# EAGLE design IOXGDv0.4.1 (EAGLE 9.5.0)
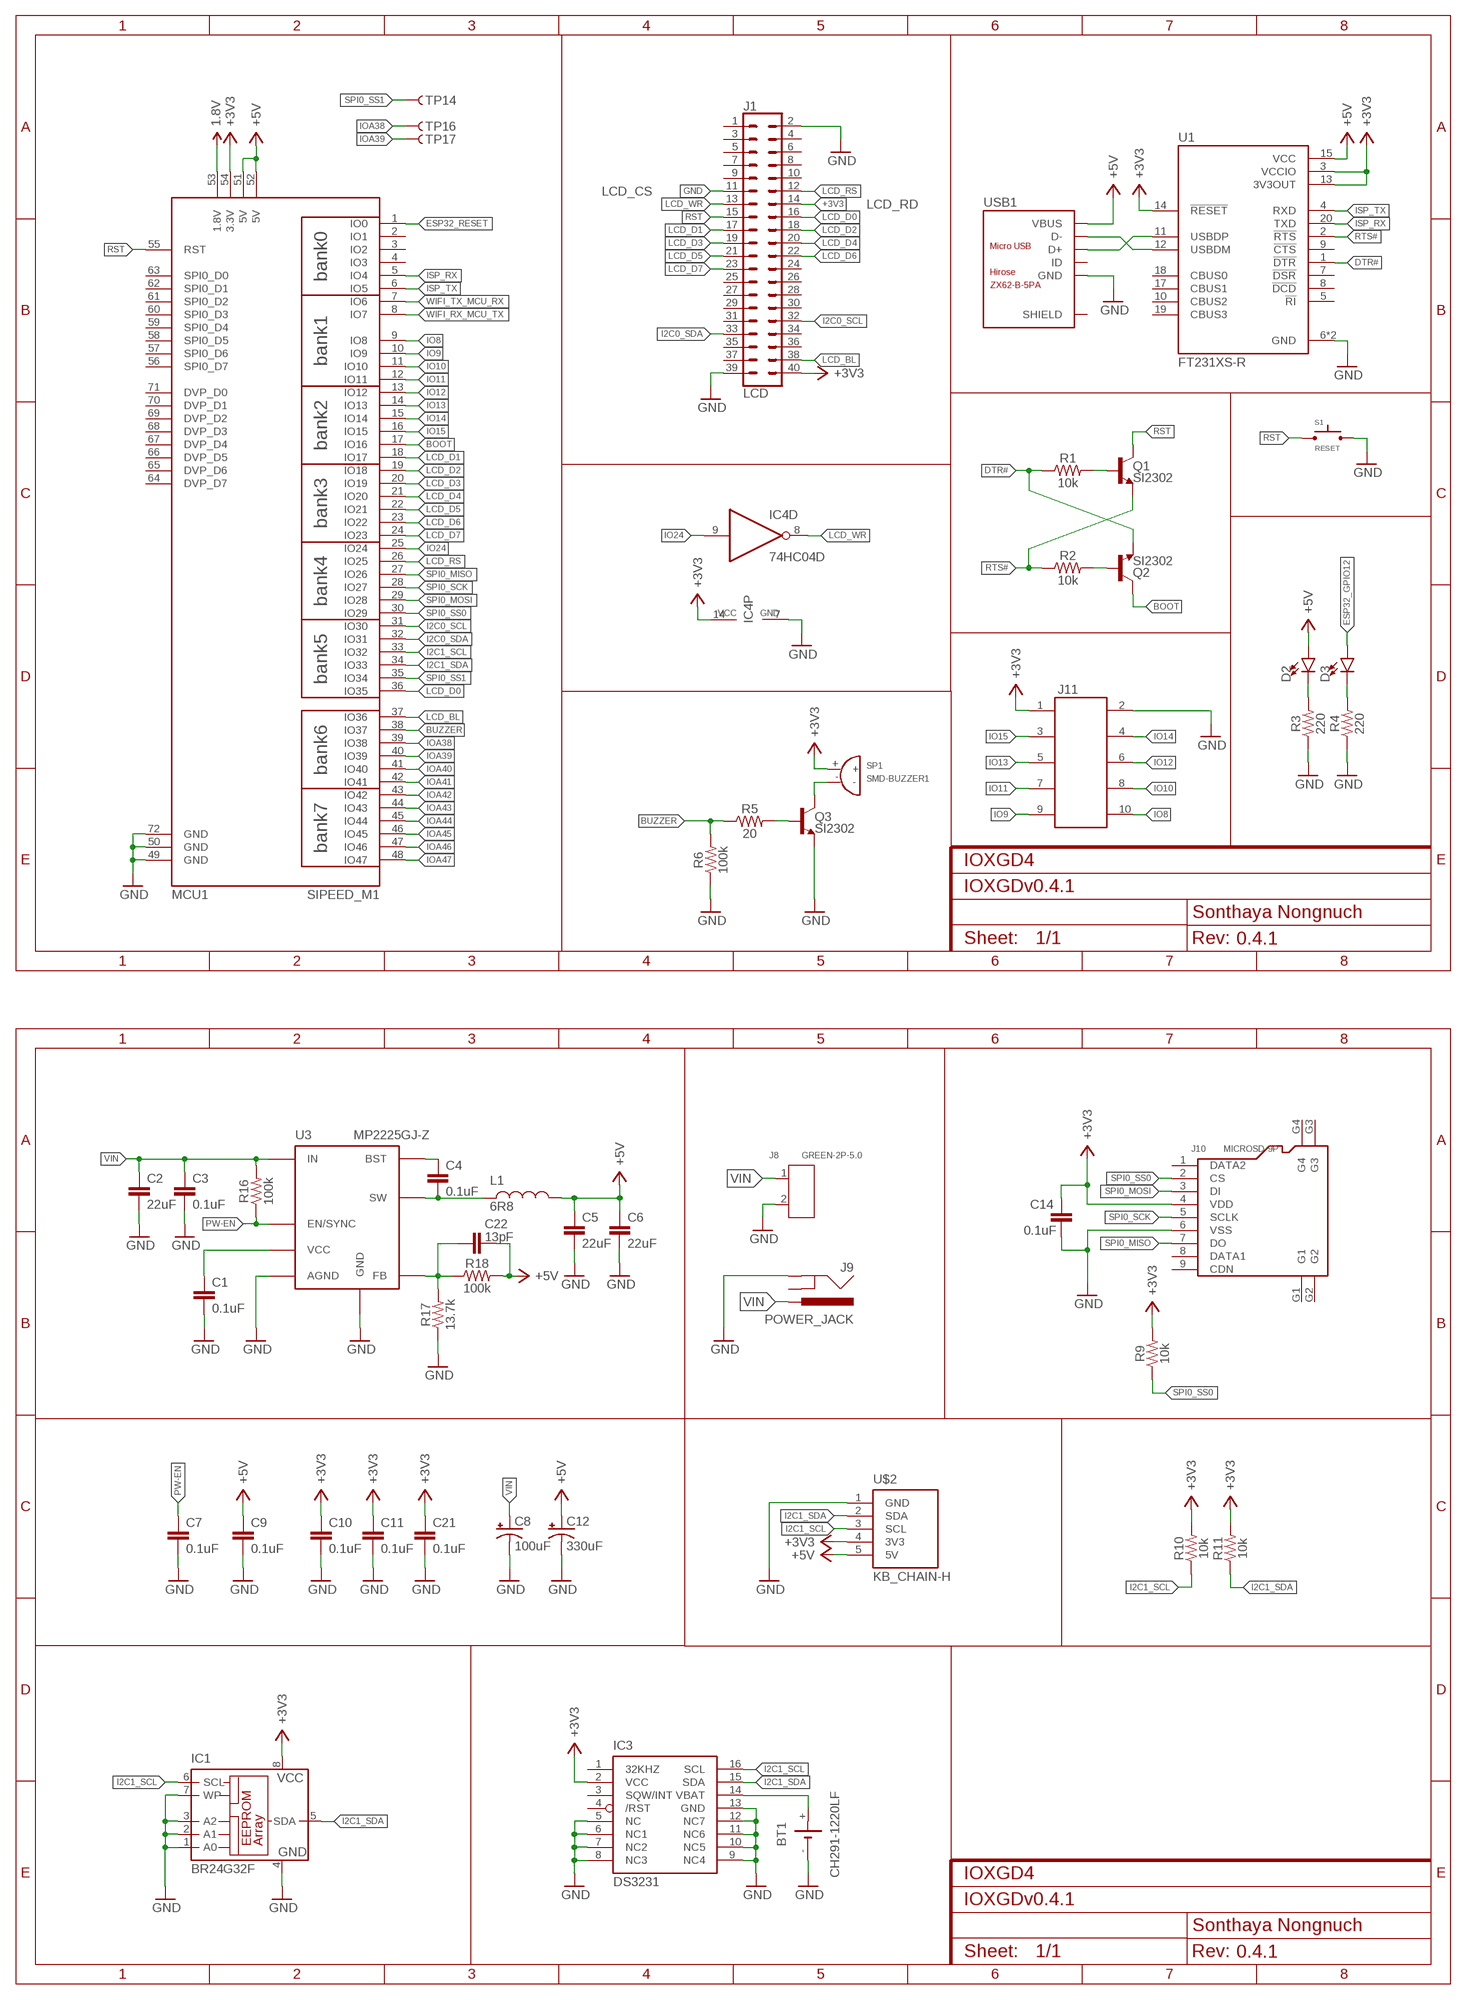
[diagram p0: schematic, sheet 1, part 1 of 2]
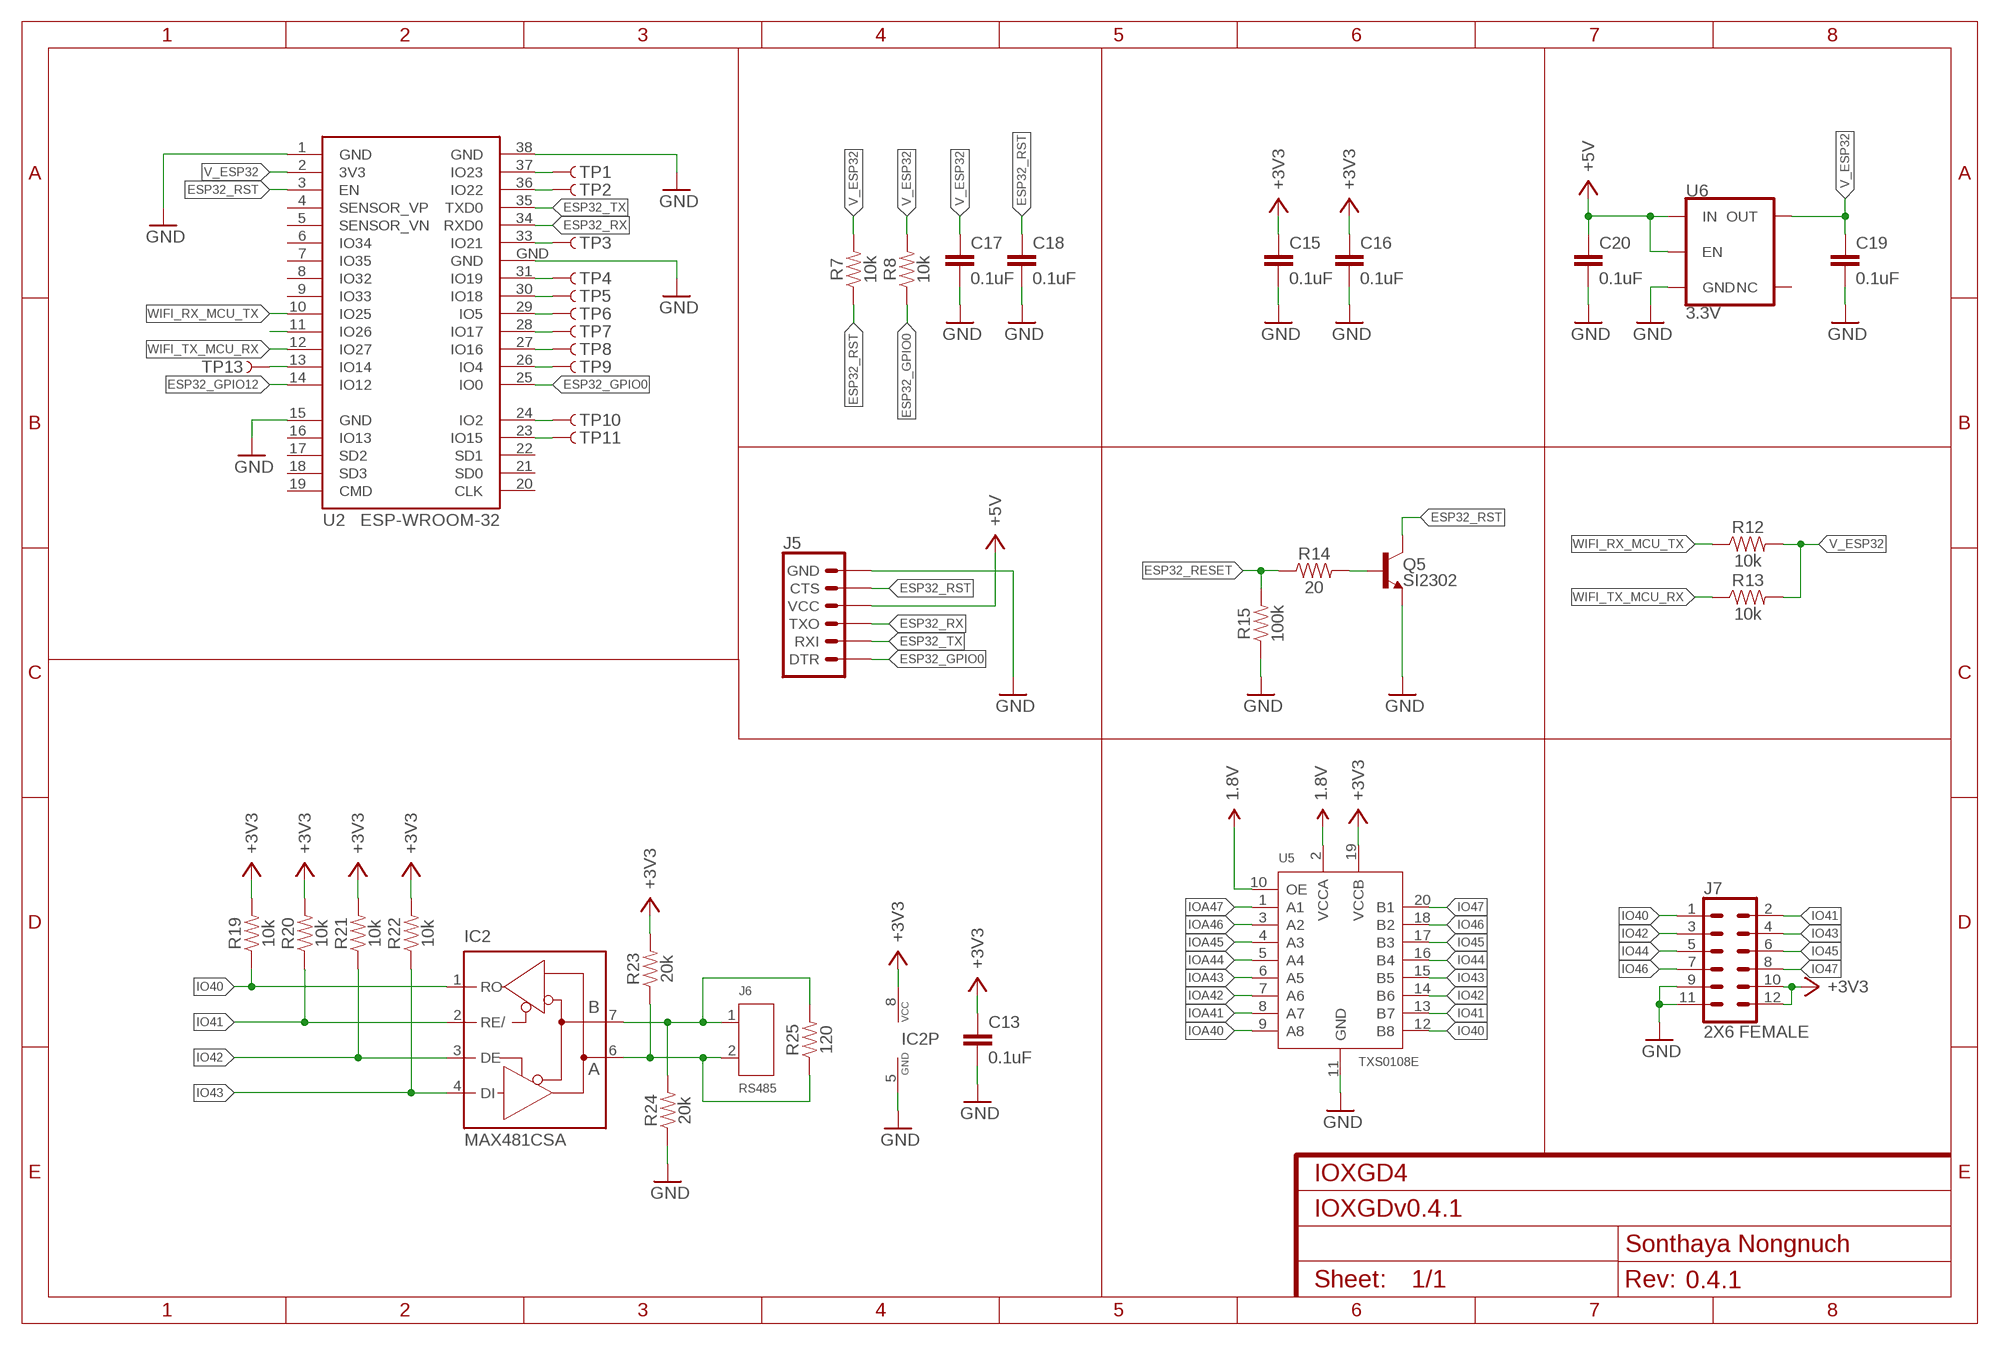
[diagram p1: schematic, sheet 1, part 2 of 2]
FRAME1 (FRAME-A4L): CNAME: IOXGD4; CREVISION: 0.4.1; DESIGNER: Sonthaya Nongnuch
FRAME2 (FRAME-A4L): CNAME: IOXGD4; CREVISION: 0.4.1; DESIGNER: Sonthaya Nongnuch
FRAME3 (FRAME-A4L): CNAME: IOXGD4; CREVISION: 0.4.1; DESIGNER: Sonthaya Nongnuch

## Parts
BT1  CH291-1220LF  [CH291-1220LF]
C1  0.1uF  0.1UF-0603-25V-(+80/-20%)  [0603]
C2  22uF  22UF-0805-6.3V-20%  [0805]
C3  0.1uF  0.1UF-0603-25V-(+80/-20%)  [0603]
C4  0.1uF  0.1UF-0603-25V-(+80/-20%)  [0603]
C5  22uF  0.1UF-0603-25V-(+80/-20%)  [0603]
C6  22uF  0.1UF-0603-25V-(+80/-20%)  [0603]
C7  0.1uF  0.1UF-0603-25V-(+80/-20%)  [0603]
C8  100uF  100UF-POLAR-RADIAL-2.5MM-25V-20%  [CPOL-RADIAL-2.5MM-6.5MM]
C9  0.1uF  0.1UF-0603-25V-(+80/-20%)  [0603]
C10  0.1uF  0.1UF-0603-25V-(+80/-20%)  [0603]
C11  0.1uF  0.1UF-0603-25V-(+80/-20%)  [0603]
C12  330uF  100UF-POLAR-RADIAL-2.5MM-25V-20%  [CPOL-RADIAL-2.5MM-6.5MM]
C13  0.1uF  0.1UF-0603-25V-(+80/-20%)  [0603]
C14  0.1uF  0.1UF-0603-25V-(+80/-20%)  [0603]
C15  0.1uF  0.1UF-0603-25V-(+80/-20%)  [0603]
C16  0.1uF  0.1UF-0603-25V-(+80/-20%)  [0603]
C17  0.1uF  0.1UF-0603-25V-(+80/-20%)  [0603]
C18  0.1uF  0.1UF-0603-25V-(+80/-20%)  [0603]
C19  0.1uF  0.1UF-0603-25V-(+80/-20%)  [0603]
C20  0.1uF  0.1UF-0603-25V-(+80/-20%)  [0603]
C21  0.1uF  0.1UF-0603-25V-(+80/-20%)  [0603]
C22  13pF  0.1UF-0603-25V-(+80/-20%)  [0603]
D2  LED3MM  [LED_3MM]
D3  LED3MM  [LED_3MM]
IC1  BR24G32F  24AA01SN  [SO-08]
IC2  MAX481CSA  [SO08]
IC3  DS3231/SO  [SO16W]
IC4  74HC04D  [SO14]
J1  LCD  CONN_20X2  [2X20]
J5  6_PIN_SERIAL_TARGET  [1X06]
J6  RS485  SCREW-TERMINAL-GREEN(2P-5.0)  [H2-5.0-10.5X8.0MM]
J7  2X6 FEMALE  CONN_06X2PTH_FEMALE  [2X6]
J8  GREEN-2P-5.0  SCREW-TERMINAL-GREEN(2P-5.0)  [H2-5.0-10.5X8.0MM]
J9  POWER_JACK  [POWER_JACK_PTH]
J10  MICROSD-9P  MICRO-SD-CARD-HOLDER-9P  [MICRO-SD9+4P-SMD-16.1X14.5X1.85MM]
J11  612010235221  [612010235221]
L1  6R8  [MCS0630SERIES]
MCU1  SIPEED_M1  [M1]
Q1  SI2302  TRANS_NPN-MMBT2222AL  [SOT23-3]
Q2  SI2302  TRANS_NPN-MMBT2222AL  [SOT23-3]
Q3  SI2302  TRANS_NPN-MMBT2222AL  [SOT23-3]
Q5  SI2302  TRANS_NPN-MMBT2222AL  [SOT23-3]
R1  10k  10KOHM-0603-1/10W-1%  [0603]
R2  10k  10KOHM-0603-1/10W-1%  [0603]
R3  220  220OHM-0603-1/10W-1%  [0603]
R4  220  220OHM-0603-1/10W-1%  [0603]
R5  20  10KOHM-0603-1/10W-1%  [0603]
R6  100k  10KOHM-0603-1/10W-1%  [0603]
R7  10k  10KOHM-0603-1/10W-1%  [0603]
R8  10k  10KOHM-0603-1/10W-1%  [0603]
R9  10k  10KOHM-0603-1/10W-1%  [0603]
R10  10k  10KOHM-0603-1/10W-1%  [0603]
R11  10k  10KOHM-0603-1/10W-1%  [0603]
R12  10k  10KOHM-0603-1/10W-1%  [0603]
R13  10k  10KOHM-0603-1/10W-1%  [0603]
R14  20  10KOHM-0603-1/10W-1%  [0603]
R15  100k  10KOHM-0603-1/10W-1%  [0603]
R16  100k  10KOHM-0603-1/10W-1%  [0603]
R17  13.7k  10KOHM-0603-1/10W-1%  [0603]
R18  100k  10KOHM-0603-1/10W-1%  [0603]
R19  10k  10KOHM-0603-1/10W-1%  [0603]
R20  10k  10KOHM-0603-1/10W-1%  [0603]
R21  10k  10KOHM-0603-1/10W-1%  [0603]
R22  10k  10KOHM-0603-1/10W-1%  [0603]
R23  20k  20KOHM-0603-1/10W-1%  [0603]
R24  20k  20KOHM-0603-1/10W-1%  [0603]
R25  120  100OHM-0603-1/4W-5%  [0603]
S1  RESET  TC-020X  [TC-020X]
SP1  SMD-BUZZER1  [SMD-BUZZER1]
TP1  TEST-POINT3X5  [PAD.03X.05]
TP2  TEST-POINT3X5  [PAD.03X.05]
TP3  TEST-POINT3X5  [PAD.03X.05]
TP4  TEST-POINT3X5  [PAD.03X.05]
TP5  TEST-POINT3X5  [PAD.03X.05]
TP6  TEST-POINT3X5  [PAD.03X.05]
TP7  TEST-POINT3X5  [PAD.03X.05]
TP8  TEST-POINT3X5  [PAD.03X.05]
TP9  TEST-POINT3X5  [PAD.03X.05]
TP10  TEST-POINT3X5  [PAD.03X.05]
TP11  TEST-POINT3X5  [PAD.03X.05]
TP13  TEST-POINT3X5  [PAD.03X.05]
TP14  TEST-POINT3X5  [PAD.03X.05]
TP16  TEST-POINT3X5  [PAD.03X.05]
TP17  TEST-POINT3X5  [PAD.03X.05]
U1  FT231XS-R  [SOP63P599X175-20N]
U2  ESP-WROOM-32  [ESP-WROOM-32]
U3  MP2225GJ-Z  [TSOT-23-8]
U5  TXS0108E  LOGIC-TXS0108EPWR(TSSOP20)  [TSSOP20-0.65-6.5X4.4MM]
U6  3.3V  V_REG_AP2112K-3.3V  [SOT23-5]
U$2  KB_CHAIN-H  [JST5PIN]
USB1  ZX62-B-5PA  MICRO-USB-SMD(ZX62-B-5PA)  [MICRO-USB5+6P-SMD-0.65-AB]

## Nets
1.8V: MCU1.53(1.8V) U5.2(VCCA) U5.10(OE)
+3V3: C10.1 C11.1 C13.1 C14.1 C15.1 C16.1 C21.1 IC1.8(VCC) IC2.8(VCC) IC3.2(VCC) IC4.14(P:VCC) J1.14 J1.40 J7.10 J7.12 J10.4(VDD) J11.1 MCU1.54(3.3V) R9.2 R10.2 R11.2 R19.2 R20.2 R21.2 R22.2 R23.2 SP1.+ U1.3(VCCIO) U1.13(3V3OUT) U1.14(!RESET) U5.19(VCCB) U$2.4(3V3)
+5V: C5.1 C6.1 C9.1 C12.1(+) C20.1 C22.2 D2.A J5.4(VCC) L1.P$2 MCU1.51(5V) MCU1.52(5V) R18.2 U1.15(VCC) U6.1(IN) U6.3(EN) U$2.5(5V) USB1.1(VBUS)
A: IC2.6(A) J6.2 R23.1 R25.1
B: IC2.7(B) J6.1 R24.2 R25.2
BOOT: MCU1.17(IO16) Q2.3(C)
BUZZER: MCU1.38(IO37) R5.1 R6.2
DTR#: Q2.2(E) R1.1 U1.1(!DTR)
ESP32_GPIO0: J5.1(DTR) R8.1 U2.25(IO0)
ESP32_GPIO2: TP10.P$1 U2.24(IO2)
ESP32_GPIO4: TP9.P$1 U2.26(IO4)
ESP32_GPIO5: TP6.P$1 U2.29(IO5)
ESP32_GPIO12: D3.A U2.14(IO12)
ESP32_GPIO14: TP13.P$1 U2.13(IO14)
ESP32_GPIO15: TP11.P$1 U2.23(IO15)
ESP32_GPIO16: TP8.P$1 U2.27(IO16)
ESP32_GPIO17: TP7.P$1 U2.28(IO17)
ESP32_GPIO18: TP5.P$1 U2.30(IO18)
ESP32_GPIO19: TP4.P$1 U2.31(IO19)
ESP32_GPIO21: TP3.P$1 U2.33(IO21)
ESP32_GPIO22: TP2.P$1 U2.36(IO22)
ESP32_GPIO23: TP1.P$1 U2.37(IO23)
ESP32_RESET: MCU1.1(IO0) R14.1 R15.2
ESP32_RST: C18.1 J5.5(CTS) Q5.3(C) R7.1 U2.3(EN)
ESP32_RX: J5.3(TXO) U2.34(RXD0)
ESP32_TX: J5.2(RXI) U2.35(TXD0)
GND: BT1.- C1.2 C2.2 C3.2 C5.2 C6.2 C7.2 C8.2(-) C9.2 C10.2 C11.2 C12.2(-) C13.2 C14.2 C15.2 C16.2 C17.2 C18.2 C19.2 C20.2 C21.2 IC1.1(A0) IC1.2(A1) IC1.3(A2) IC1.4(GND) IC1.7(WP) IC2.5(GND) IC3.5(NC) IC3.6(NC1) IC3.7(NC2) IC3.8(NC3) IC3.9(NC4) IC3.10(NC5) IC3.11(NC6) IC3.12(NC7) IC3.13(GND) IC4.7(P:GND) J1.2 J1.11 J1.39 J5.6(GND) J7.9 J7.11 J8.2 J9.GND J10.6(VSS) J11.2 MCU1.49(GND) MCU1.50(GND) MCU1.72(GND) Q3.2(E) Q5.2(E) R3.1 R4.1 R6.1 R15.1 R17.1 R24.1 S1.2 U1.6(GND) U1.16(GND) U2.1(GND) U2.15(GND) U2.38(GND) U2.GND U3.1(AGND) U3.4(GND) U5.11(GND) U6.2(GND) U$2.1(GND) USB1.5(GND)
I2C0_SCL: J1.32 MCU1.31(IO30)
I2C0_SDA: J1.33 MCU1.32(IO31)
I2C1_SCL: IC1.6(SCL) IC3.16(SCL) MCU1.33(IO32) R10.1 U$2.3(SCL)
I2C1_SDA: IC1.5(SDA) IC3.15(SDA) MCU1.34(IO33) R11.1 U$2.2(SDA)
IO8: J11.10 MCU1.9(IO8)
IO9: J11.9 MCU1.10(IO9)
IO10: J11.8 MCU1.11(IO10)
IO11: J11.7 MCU1.12(IO11)
IO12: J11.6 MCU1.13(IO12)
IO13: J11.5 MCU1.14(IO13)
IO14: J11.4 MCU1.15(IO14)
IO15: J11.3 MCU1.16(IO15)
IO24: IC4.9(D:I) MCU1.25(IO24)
IO40: IC2.1(RO) J7.1 R19.1 U5.12(B8)
IO41: IC2.2(RE/) J7.2 R20.1 U5.13(B7)
IO42: IC2.3(DE) J7.3 R21.1 U5.14(B6)
IO43: IC2.4(DI) J7.4 R22.1 U5.15(B5)
IO44: J7.5 U5.16(B4)
IO45: J7.6 U5.17(B3)
IO46: J7.7 U5.18(B2)
IO47: J7.8 U5.20(B1)
IOA38: MCU1.39(IO38) TP16.P$1
IOA39: MCU1.40(IO39) TP17.P$1
IOA40: MCU1.41(IO40) U5.9(A8)
IOA41: MCU1.42(IO41) U5.8(A7)
IOA42: MCU1.43(IO42) U5.7(A6)
IOA43: MCU1.44(IO43) U5.6(A5)
IOA44: MCU1.45(IO44) U5.5(A4)
IOA45: MCU1.46(IO45) U5.4(A3)
IOA46: MCU1.47(IO46) U5.3(A2)
IOA47: MCU1.48(IO47) U5.1(A1)
ISP_RX: MCU1.5(IO4) U1.20(TXD)
ISP_TX: MCU1.6(IO5) U1.4(RXD)
LCD_BL: J1.38 MCU1.37(IO36)
LCD_D0: J1.16 MCU1.36(IO35)
LCD_D1: J1.17 MCU1.18(IO17)
LCD_D2: J1.18 MCU1.19(IO18)
LCD_D3: J1.19 MCU1.20(IO19)
LCD_D4: J1.20 MCU1.21(IO20)
LCD_D5: J1.21 MCU1.22(IO21)
LCD_D6: J1.22 MCU1.23(IO22)
LCD_D7: J1.23 MCU1.24(IO23)
LCD_RS: J1.12 MCU1.26(IO25)
LCD_WR: IC4.8(D:O) J1.13
N$1: U1.11(USBDP) USB1.3(D+)
N$2: U1.12(USBDM) USB1.2(D-)
N$3: Q2.1(B) R2.2
N$4: Q1.1(B) R1.2
N$5: BT1.+ IC3.14(VBAT)
N$6: C1.1 U3.7(VCC)
N$7: D2.K(C) R3.2
N$8: D3.K(C) R4.2
N$10: Q3.3(C) SP1.-
N$11: Q3.1(B) R5.2
N$12: C4.1 U3.5(BST)
N$13: C4.2 L1.P$1 U3.3(SW)
N$14: C22.1 R17.2 R18.1 U3.8(FB)
N$15: Q5.1(B) R14.2
N$18: U2.11(IO26)
PW-EN: C7.1 R16.1 U3.6(EN/SYNC)
RST: J1.15 MCU1.55(RST) Q1.3(C) S1.1
RTS#: Q1.2(E) R2.1 U1.2(!RTS)
SPI0_MISO: J10.7(DO) MCU1.27(IO26)
SPI0_MOSI: J10.3(DI) MCU1.29(IO28)
SPI0_SCK: J10.5(SCLK) MCU1.28(IO27)
SPI0_SS0: J10.2(CS) MCU1.30(IO29) R9.1
SPI0_SS1: MCU1.35(IO34) TP14.P$1
V_ESP32: C17.1 C19.1 R7.2 R8.2 R12.2 R13.2 U2.2(3V3) U6.5(OUT)
VIN: C2.1 C3.1 C8.1(+) J8.1 J9.PWR R16.2 U3.2(IN)
WIFI_RX_MCU_TX: MCU1.8(IO7) R12.1 U2.10(IO25)
WIFI_TX_MCU_RX: MCU1.7(IO6) R13.1 U2.12(IO27)
Unconnected: IC3.1(32KHZ) IC3.3(SQW/INT) IC3.4(/RST) IC4.1(A:I) IC4.2(A:O) IC4.3(B:I) IC4.4(B:O) IC4.5(C:I) IC4.6(C:O) IC4.10(E:O) IC4.11(E:I) IC4.12(F:O) IC4.13(F:I) J1.1 J1.3 J1.4 J1.5 J1.6 J1.7 J1.8 J1.9 J1.10 J1.24 J1.25 J1.26 J1.27 J1.28 J1.29 J1.30 J1.31 J1.34 J1.35 J1.36 J1.37 J9.GNDBREAK J10.1(DATA2) J10.8(DATA1) J10.9(CDN) J10.G1 J10.G2 J10.G3 J10.G4 MCU1.2(IO1) MCU1.3(IO2) MCU1.4(IO3) MCU1.56(SPI0_D7) MCU1.57(SPI0_D6) MCU1.58(SPI0_D5) MCU1.59(SPI0_D4) MCU1.60(SPI0_D3) MCU1.61(SPI0_D2) MCU1.62(SPI0_D1) MCU1.63(SPI0_D0) MCU1.64(DVP_D7) MCU1.65(DVP_D6) MCU1.66(DVP_D5) MCU1.67(DVP_D4) MCU1.68(DVP_D3) MCU1.69(DVP_D2) MCU1.70(DVP_D1) MCU1.71(DVP_D0) U1.5(!RI) U1.7(!DSR) U1.8(!DCD) U1.9(!CTS) U1.10(CBUS2) U1.17(CBUS1) U1.18(CBUS0) U1.19(CBUS3) U2.4(SENSOR_VP) U2.5(SENSOR_VN) U2.6(IO34) U2.7(IO35) U2.8(IO32) U2.9(IO33) U2.16(IO13) U2.17(SD2) U2.18(SD3) U2.19(CMD) U2.20(CLK) U2.21(SD0) U2.22(SD1) U6.4(NC) USB1.4(ID) USB1.P1(SHIELD) USB1.P2(SHIELD) USB1.P3(SHIELD) USB1.P4(SHIELD) USB1.P5(SHIELD) USB1.P6(SHIELD)

## Notes on the sheet
- LCD_CS
- LCD_RD

## Library data of the parts
BT1 = battery:CH291-1220LF: Battery Holder, SMT, 12mm multicomp PART NO. CH291-1220LF Source: Data sheet <http://www.farnell.com/datasheets/1505860.pdf>
C1 C3 C4 C7 C9-C11 C13-C21 = SparkFun-Capacitors:0.1UF: 0.1µF ceramic capacitors A capacitor is a passive two-terminal electrical component used to store electrical energy temporarily in an electric field.; PROD_ID: CAP-00810
C2 = SparkFun-Capacitors:22UF: 22µF ceramic capacitors A capacitor is a passive two-terminal electrical component used to store electrical energy temporarily in an electric field.; PROD_ID: CAP-08402
C5 C6 C22 = SparkFun-Capacitors:0.1UF: 0.1µF ceramic capacitors A capacitor is a passive two-terminal electrical component used to store electrical energy temporarily in an electric field.; PROD_ID: CAP-00810; VALUE: 0.1uF
C8 = SparkFun-Capacitors:100UF-POLAR: 100µF polarized capacitors A capacitor is a passive two-terminal electrical component used to store electrical energy temporarily in an electric field.; PROD_ID: CAP-08439
C12 = SparkFun-Capacitors:100UF-POLAR: 100µF polarized capacitors A capacitor is a passive two-terminal electrical component used to store electrical energy temporarily in an electric field.; PROD_ID: CAP-08439; VALUE: 100uF
D2 D3 = SparkFun-LED:LED: LED (Generic) Standard schematic elements and footprints for 5mm, 3mm, 1206, and 0603 sized LEDs. Generic LEDs with no color specified.; PROD_ID: DIO-08794
IC1 = microchip:24*: Serial EEPROM I2C; MF: MICROCHIP; MPN: 24AA01/SN; OC_FARNELL: 1331268; OC_NEWARK: 89C9792
IC2 = maxim:MAX481CSA: RS485 TRANSEIVER; MF: MAXIM; MPN: MAX481CSA; OC_FARNELL: unknown; OC_NEWARK: 90C3817
IC3 = DS3231:DS3231; AVAILABILITY: Unavailable; MF: Maxim Integrated; MP: DS3231; PACKAGE: SOIC-16 Maxim Integrated; PRICE: None
IC4 = 74xx-eu:74*04: Hex INVERTER
J1 = SparkFun-Connectors:CONN_20X2: Multi connection point. Often used as Generic Header-pin footprint for 0.1 inch spaced/style header connections On any of the 0.1 inch spaced packages, you can populate with these: Break Away Headers - Straight <https://www.sparkfun.com/products/116> (PRT-00116) Break Away Male Headers - Right Angle <https://www.sparkfun.com/products/553> (PRT-00553) Female Headers <https://www.sparkfun.com/products/115> (PRT-00115) Break Away Headers - Machine Pin <https://www.sparkfun.com/products/117> (PRT-00117) Break Away Female Headers - Swiss Machine Pin <https://www.sparkfun.com/products/743> (PRT-00743)
J5 = SparkFun-Connectors:6_PIN_SERIAL_TARGET: 6-pin header connection for use with the "FTDI BASIC" pinout - TARGET SIDE. Also known as "Arduino Serial Program Header". It is used to mate with our FTDI Basic serial programmers using the Arduino IDE. Note, this device has "TARGET" in the name. It is intended to be used on a design that contains a target micro-controller that you wish to program. The "sister" device, named "CABLE" is inteneded to be used on a design that usually lives on the end of your USB cable and prvides the converter chip (FTDI232 or FTDI231x) to commnicate serial RX/TX. You can populate with some of these: Break Away Headers - Straight <https://www.sparkfun.com/products/116> (PRT-00116) For reference (or to suit your programming needs) check out these designs: SparkFun FTDI Basic Breakout - 5V <https://www.sparkfun.com/products/9716> (DEV-09716) SparkFun FTDI Basic Breakout - 3.3V <https://www.sparkfun.com/products/9873> (DEV-09873) SparkFun FTDI SmartBasic <https://www.sparkfun.com/products/12935> (DEV-12935) SparkFun Beefy 3 - FTDI Basic Breakout <https://www.sparkfun.com/products/13746> (DEV-13746)
J6 = OPL_Connector:SCREW-TERMINAL-GREEN(2P-5.0): 320110031; VALUE: GREEN-2P-5.0
J7 = SparkFun-Connectors:CONN_06X2: Multi connection point. Often used as Generic Header-pin footprint for 0.1 inch spaced/style header connections On any of the 0.1 inch spaced packages, you can populate with these: Break Away Headers - Straight <https://www.sparkfun.com/products/116> (PRT-00116) Break Away Male Headers - Right Angle <https://www.sparkfun.com/products/553> (PRT-00553) Female Headers <https://www.sparkfun.com/products/115> (PRT-00115) Break Away Headers - Machine Pin <https://www.sparkfun.com/products/117> (PRT-00117) Break Away Female Headers - Swiss Machine Pin <https://www.sparkfun.com/products/743> (PRT-00743); PROD_ID: CONN-12423
J8 = OPL_Connector:SCREW-TERMINAL-GREEN(2P-5.0): 320110031
J9 = SparkFun-Connectors:POWER_JACK: Power Jack Connector This is the standard 5.5mm barrel jack for power. The PTH is the most common, proven, reliable, footprint. The Slot footprint only works if the mill layer is transmitted to the PCB fab house so be warned. Here are the connectors we sell at SparkFun: DC Barrel Power Jack/Connector <https://www.sparkfun.com/products/119> (PRT-00119) DC Barrel Power Jack/Connector (SMD) <https://www.sparkfun.com/products/12748> (PRT-12748) DC Barrel Jack Adapter - Breadboard Compatible <https://www.sparkfun.com/products/10811> (PRT-10811) It is used on this SparkFun product (and many, many others): SparkFun RedBoard - Programmed with Arduino <https://www.sparkfun.com/products/12757> (DEV-12757) Also, if you need a mating power supply or connector, please check these out: Wall Adapter Power Supply - 9VDC 650mA <https://www.sparkfun.com/products/298> (TOL-00298) DC Barrel Jack Adapter - Male <https://www.sparkfun.com/products/10287> (PRT-10287); PROD_ID: CONN-08197
J10 = OPL_Connector:MICRO-SD-CARD-HOLDER-9P: 320090008
J11 = Wurth_Elektronik_Electromechanic_Wire_to_Board_Connectors_rev19a:612010235221: WR-BHD 2.54mm Male Angled Box Header High Temperature, 10 Pins=>Code : Con_WTB_BHD_2.54_Male_THT_RS_612010235221 <http://katalog.we-online.de/media/thumbs2/eican/thb_Con_WTB_BHD_2.54_Male_THT_RS_6120xx235221_pf2.jpg> Details see: http://katalog.we-online.de/en/em/612_0xx_235_221 Created 2014-06-05, Karrer Zheng 2014 (C) Würth Elektronik
L1 = IOXhop-Inductors:6R8
MCU1 = SiPEED:SIPEED_M1
Q1-Q3 Q5 = SparkFun-DiscreteSemi:TRANS_NPN: NPN transistor Current controlled devices typically used to amplify current or used as a switch. BC547 - COM-08928 <http://www.sparkfun.com/products/8928> (TO-92 45V 100mA) (1.Collector 2.Base 3.Emitter) 2N3904 - COM-00521 <http://www.sparkfun.com/products/521> (TO-92 40V 200mA) (1.Emitter 2.Base 3.Collector) P2N2222A - COM-12852 <http://www.sparkfun.com/products/12852> (TO-92 40V 600mA) (1.Collector 2.Base 3.Emitter); PROD_ID: TRANS-08049; VALUE: 600mA/40V
R1 R2 R7-R13 R19-R22 = SparkFun-Resistors:10KOHM: 10kΩ resistor A resistor is a passive two-terminal electrical component that implements electrical resistance as a circuit element. Resistors act to reduce current flow, and, at the same time, act to lower voltage levels within circuits. - Wikipedia; PROD_ID: RES-00824
R3 R4 = SparkFun-Resistors:220OHM: 220Ω resistor A resistor is a passive two-terminal electrical component that implements electrical resistance as a circuit element. Resistors act to reduce current flow, and, at the same time, act to lower voltage levels within circuits. - Wikipedia; PROD_ID: RES-07861
R5 R6 R14-R18 = SparkFun-Resistors:10KOHM: 10kΩ resistor A resistor is a passive two-terminal electrical component that implements electrical resistance as a circuit element. Resistors act to reduce current flow, and, at the same time, act to lower voltage levels within circuits. - Wikipedia; PROD_ID: RES-00824; VALUE: 10k
R23 R24 = SparkFun-Resistors:20KOHM: 20kΩ resistor A resistor is a passive two-terminal electrical component that implements electrical resistance as a circuit element. Resistors act to reduce current flow, and, at the same time, act to lower voltage levels within circuits. - Wikipedia; PROD_ID: RES-09383
R25 = SparkFun-Resistors:100OHM: 100Ω resistor A resistor is a passive two-terminal electrical component that implements electrical resistance as a circuit element. Resistors act to reduce current flow, and, at the same time, act to lower voltage levels within circuits. - Wikipedia; PROD_ID: RES-12438; VALUE: 100
S1 = IOXhop Switch:TC-020X
SP1 = IOXhop-Buzzer:SMD-BUZZER1
TP1-TP11 TP13 TP14 TP16 TP17 = SparkFun-Connectors:TEST-POINT: SparkFun Test Points Bare copper test points for troubleshooting or In-Circuit-Testing. These are used by our Production team for verifying production board runs using pogo-pins on test beds. SparkFun Products: SparkFun LSM9DS1 Breakout <https://www.sparkfun.com/products/13284> SparkFun PSOC <https://www.sparkfun.com/products/13714> SparkFun Load Cell Amplifier <https://www.sparkfun.com/products/13879>
U1 = FT231XS-R:FT231XS-R: USB Full Speed to Full Handshake UART with USB Charger Detection; DESCRIPTION: USB Full Speed to Full Handshake UART with USB Charger Detection; DIGI-KEY_PART_NUMBER: 768-1129-1-ND; DIGI-KEY_PURCHASE_URL: https://www.digikey.co.th/product-detail/en/ftdi-future-technology-devices-international-ltd/FT231XS-R/768-1129-1-ND/3029151?utm_source=snapeda&utm_medium=aggregator&utm_campaign=symbol; MF: FTDI,; MP: FT231XS-R; PACKAGE: SSOP-20 FTDI
U2 = esp322:ESP-WROOM-32: Espressif Systems ESP-WROOM-32
U3 = IOXhop-IC-Power:MP2225GJ-Z: Overvoltage, Undervoltage and Reverse Supply Protection Controller Application Power Protection Documentation Datasheet <http://cds.linear.com/docs/en/datasheet/4365fa.pdf> General Description The LTC®4365 protects applications where power supply input voltages may be too high, too low or even negative. It does this by controlling the gate voltages of a pair of external N-channel MOSFETs to ensure that the output stays within a safe operating range.The LTC4365 can withstand voltages between –40V and 60V and has an operating range of 2.5V to 34V, while consuming only 125µA in normal operation. Two comparator inputs allow configuration of the overvoltage (OV) and undervoltage (UV) set points using an external resistive divider.Ashutdown pin provides external control for enabling and disabling the MOSFETs as well as placing the device in a low current shutdown state. A fault output provides status of the gate pin pulling low. A fault is indicated when the part is in shutdown or the input voltage is outside the UV and OV set points. The LTC4365 has a 36ms turn-on delay that debounces live connections and blocks 50Hz to 60Hz AC power. For fast recovery after faults, the LTC4365-1 has a reduced 1ms turn-on delay. Features Wide Operating Voltage Range: 2.5V to 34V Overvoltage Protection to 60V Reverse Supply Protection to -40V LTC5364: Blocks 50Hz and 60Hz AC Power LTC4356-1: Fast (1ms) Recovery from Fault No Input Capacitor or TVS Required for Most Applications Adjustable Undervoltage and Overvoltage Protection Range Charge Pump Enhances External N-Channel MOSFET Low Operating Current: 125uA Low Shutdown Current: 10uA Compact 8-Lead, 3mm x 2mm DFN and TSOT-23 (ThinSOT) Packages Applications Portable Instrumentation Industrial Automation Laptops Automotive Surge Protection; APPLICATIONS: Overvoltage, Undervoltage Protection; CATEGORY: Integrated Circuits (ICs); CURRENT-SUPPLY: 125uA; DESCRIPTION: IC OVERVOLTAGE PROT TSOT23-8; DOCUMENTATION_LINK: <a href="http://cds.linear.com/docs/en/datasheet/4365fa.pdf">Datasheet</a>; DOCUMENTATION_URL: http://cds.linear.com/docs/en/datasheet/4365fa.pdf; FAMILY: PMIC - Power Management - Specialized; MANUFACTURER: Linear Technology; MOUNTING_TYPE: Surface Mount; OPERATING_TEMPERATURE: 0C ~ 70C; PACKAGE-CASE: SOT-23-8 Thin, TSOT-23-8; PART_NUMBER: LTC4365CTS8#TRMPBF; SERIES: -; SUPPLIER_DEVICE_PACKAGE: SOT-23-8; SUPPLIER_ITEM_INFO: http://www.digikey.com/product-detail/en/LTC4365CTS8%23TRMPBF/LTC4365CTS8%23TRMPBFCT-ND/2404677; SUPPLIER_ITEM_LINK: <a href="http://www.digikey.com/product-detail/en/LTC4365CTS8%23TRMPBF/LTC4365CTS8%23TRMPBFCT-ND/2404677">Details</a>; SUPPLIER_ITEM_NUMBER: LTC4365CTS8#TRMPBFCT-ND; SUPPLIER_ITEM_URL: http://www.digikey.com/product-detail/en/LTC4365CTS8%23TRMPBF/LTC4365CTS8%23TRMPBFCT-ND/2404677; SUPPLIER_LINK: <a href="http://www.digikey.com">Home Page</a>; SUPPLIER_NAME: Digi-Key; SUPPLIER_URL: http://www.digikey.com; VOLTAGE-SUPPLY: 2.5V ~ 34V
U5 = Seeed-IC:LOGIC-TXS0108EPWR(TSSOP20): 310050026; MPN: TXS0108EPWR; VALUE: TXS0108EPWR-TSSOP20
U6 = SparkFun-IC-Power:V_REG_AP2112: AP2112 - 600mA CMOS LDO Regulator w/ Enable The AP2112 is CMOS process low dropout linear regulator with enable function, the regulator delivers a guaranteed 600mA (min.) continuous load current. Features Output Voltage Accuracy: ±1.5% Output Current: 600mA (Min.) Foldback Short Current Protection: 50mA Enable Function to Turn ON/OFF VOUT Low Dropout Voltage (3.3V): 250mV (Typ.) @IOUT=600mA Excellent Load Regulation: 0.2%/A (Typ.) Excellent Line Regulation: 0.02%/V (Typ.) Low Quiescent Current: 55μA (Typ.) Low Standby Current: 0.01μA (Typ.) Low Output Noise: 50μVRMS PSRR: 100Hz -65dB, 1kHz -65dB OTSD Protection Stable with 1.0μF Flexible Cap: Ceramic, Tantalum and Aluminum Electrolytic Operation Temperature Range: -40°C to 85°C ESD: MM 400V, HBM 4000V; PROD_ID: VREG-12457
U$2 = IOXhop Connector:KB_CHAIN
USB1 = OPL_Connector:MICRO-USB-SMD(ZX62-B-5PA): 320010005; MPN: ZX62-B-5PA

## Module UART
Ports: 

### Library data of the parts

## Board
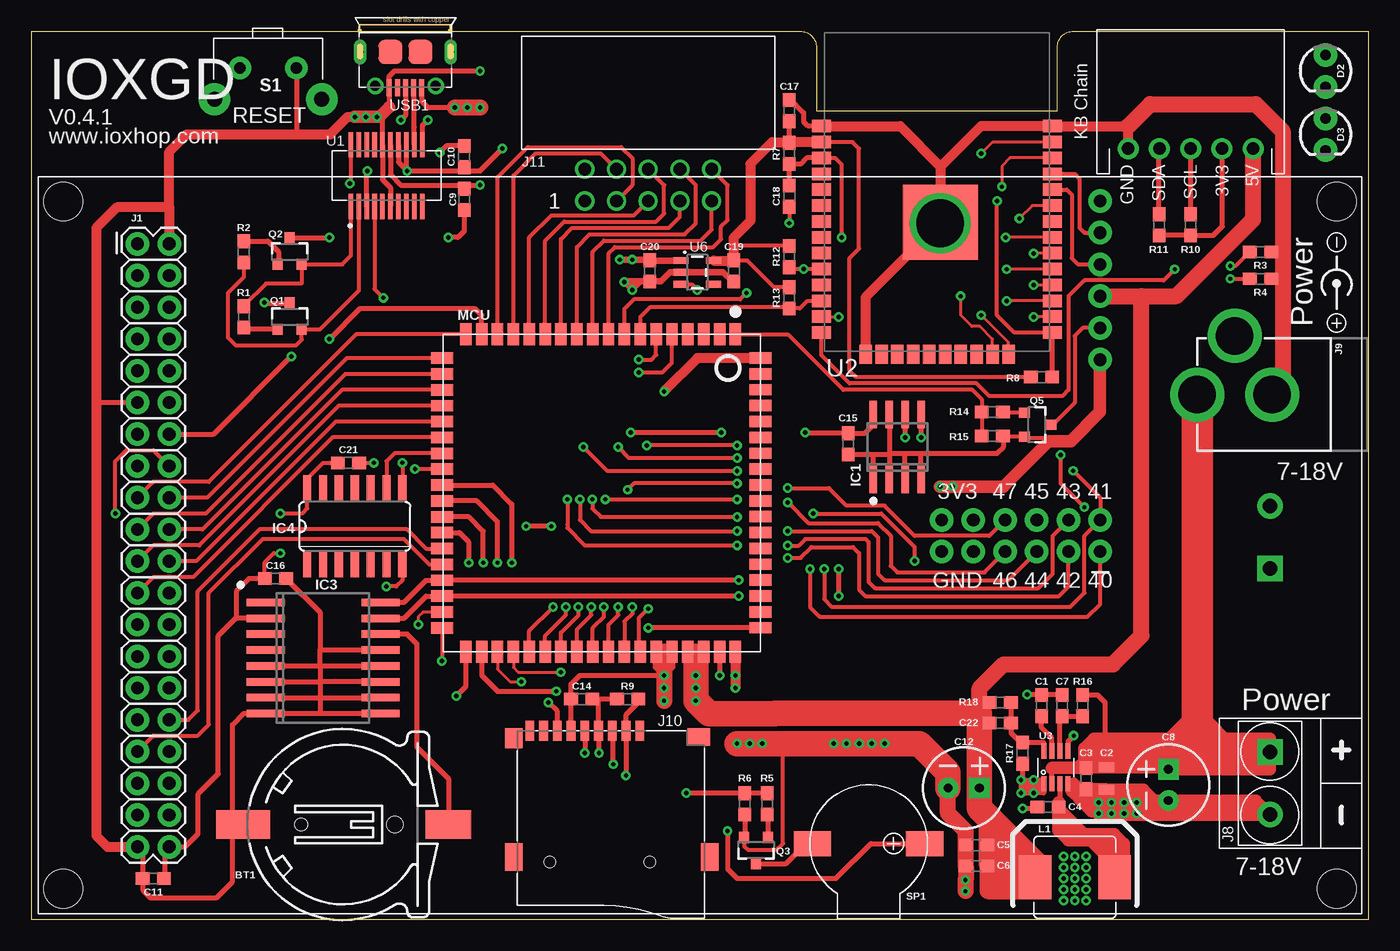
[diagram p2: board, top side]
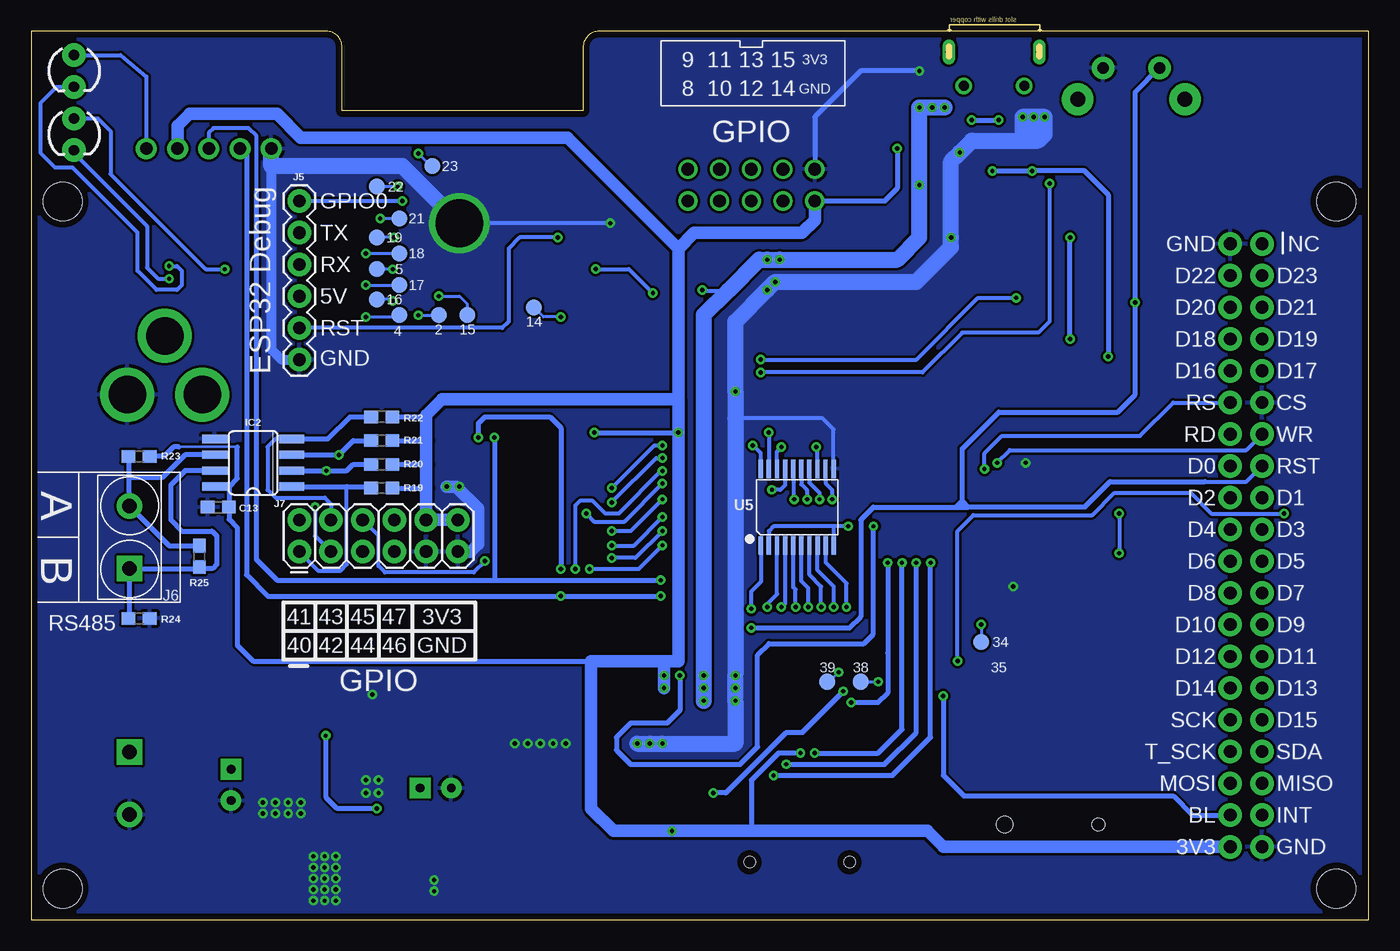
[diagram p3: board, bottom side, seen from below]

Size 107.06 x 71.12 mm. Coordinates in mm from the lower left corner, seen from the top.
Outline: 0,71.12 0,0 107.06,0 107.06,71.12 83.44,71.12 arc90 82.17,69.85 82.17,64.77 62.87,64.77 62.87,69.85 arc90 61.6,71.12 0,71.12
Copper layers (1*16): Top 0.035mm / dielectric 1.5mm / Bottom 0.035mm
Design rules "default *": minimum track width 6mil, minimum drill 0.35mm, track to track 8mil, track to pad 6mil, pad to pad 6mil, via to via 6mil, smd to smd 6mil, copper to edge 20mil, drill to drill 6mil, minimum pad ring 10mil, minimum via ring 8mil, stop-mask expansion 4mil, vias tented up to drill 20mil, thermal gap 10mil
Holes 3.1 mm at 104.55,57.49 104.55,2.49 2.55,2.49 2.55,57.49

### Footprints (pad centres in the part's own frame; a part is rotated, then mirrored left to right if it is on the bottom)
CH291-1220LF = smd 2.3 x 3.66: + 0,-2.296 | smd 2.3 x 4.3: - 0,14.146 | hole 1.3: 0,2 | hole 1: 0,9.5
0603 = smd 1.1 x 1: 1 -0.85,0; 2 0.85,0
0805 = smd 0.8 x 1.2: 1 -0.9,0; 2 0.9,0
CPOL-RADIAL-2.5MM-6.5MM = drill 0.7 pad 1.651 square: 1 1.25,0 | drill 0.7 pad 1.651: 2 -1.25,0
LED_3MM = drill 0.813 pad 1.88: A -1.27,0; K 1.27,0
SO-08 = smd 0.6 x 2.2: 1 -1.905,-2.6; 2 -0.635,-2.6; 3 0.635,-2.6; 4 1.905,-2.6; 5 1.905,2.6; 6 0.635,2.6; 7 -0.635,2.6; 8 -1.905,2.6
SO08 = smd 0.66 x 2.032: 1 -1.905,-3.073; 2 -0.635,-3.073; 3 0.635,-3.073; 4 1.905,-3.073; 5 1.905,3.073; 6 0.635,3.073; 7 -0.635,3.073; 8 -1.905,3.073
SO16W = smd 0.6 x 3.048: 1 -4.445,-4.6; 2 -3.175,-4.6; 3 -1.905,-4.6; 4 -0.635,-4.6; 5 0.635,-4.6; 6 1.905,-4.6; 7 3.175,-4.6; 8 4.445,-4.6; 9 4.445,4.6; 10 3.175,4.6; 11 1.905,4.6; 12 0.635,4.6; 13 -0.635,4.6; 14 -1.905,4.6; 15 -3.175,4.6; 16 -4.445,4.6
SO14 = smd 0.66 x 2.032: 1 -3.81,-3.073; 2 -2.54,-3.073; 3 -1.27,-3.073; 4 0,-3.073; 5 1.27,-3.073; 6 2.54,-3.073; 7 3.81,-3.073; 8 3.81,3.073; 9 2.54,3.073; 10 1.27,3.073; 11 0,3.073; 12 -1.27,3.073; 13 -2.54,3.073; 14 -3.81,3.073
2X20 = drill 1.016 pad 1.88: 1 0,0; 2 0,2.54; 3 2.54,0; 4 2.54,2.54; 5 5.08,0; 6 5.08,2.54; 7 7.62,0; 8 7.62,2.54; 9 10.16,0; 10 10.16,2.54; 11 12.7,0; 12 12.7,2.54; 13 15.24,0; 14 15.24,2.54; 15 17.78,0; 16 17.78,2.54; 17 20.32,0; 18 20.32,2.54; 19 22.86,0; 20 22.86,2.54; 21 25.4,0; 22 25.4,2.54; 23 27.94,0; 24 27.94,2.54; 25 30.48,0; 26 30.48,2.54; 27 33.02,0; 28 33.02,2.54; 29 35.56,0; 30 35.56,2.54; 31 38.1,0; 32 38.1,2.54; 33 40.64,0; 34 40.64,2.54; 35 43.18,0; 36 43.18,2.54; 37 45.72,0; 38 45.72,2.54; 39 48.26,0; 40 48.26,2.54
1X06 = drill 1.016 pad 1.88: 1 0,0; 2 2.54,0; 3 5.08,0; 4 7.62,0; 5 10.16,0; 6 12.7,0
H2-5.0-10.5X8.0MM = drill 1.168 pad 2.032 square: 1 0,2.5 | drill 1.168 pad 2.032: 2 0,-2.5
2X6 = drill 1.016 pad 1.88: 1 0,0; 2 0,2.54; 3 2.54,0; 4 2.54,2.54; 5 5.08,0; 6 5.08,2.54; 7 7.62,0; 8 7.62,2.54; 9 10.16,0; 10 10.16,2.54; 11 12.7,0; 12 12.7,2.54
POWER_JACK_PTH = drill 2.997 pad 4.318: GND 0,7.7; GNDBREAK 4.7,10.7; PWR 0,13.7
MICRO-SD9+4P-SMD-16.1X14.5X1.85MM = smd 1.6 x 0.7: 1 0,2.25; 2 0,1.15; 3 0,0.05; 4 0,-1.05; 5 0,-2.15; 6 0,-3.25; 7 0,-4.35; 8 0,-5.45; 9 0,-6.55 | smd 1.6 x 1.4: G1 0.6,-7.85 | smd 2.2 x 1.4: G2 10.1,-7.85; G3 10.1,7.85 | smd 1.4 x 1.8: G4 0.5,6.95 | hole 0.9: 10.5,-4.95; 10.5,3.05
612010235221 = drill 1.02: 1 5.08,1.27; 2 5.08,-1.27; 3 2.54,1.27; 4 2.54,-1.27; 5 0,1.27; 6 0,-1.27; 7 -2.54,1.27; 8 -2.54,-1.27; 9 -5.08,1.27; 10 -5.08,-1.27
MCS0630SERIES = smd 2.6 x 3.5: P$1 -3.2,-0.1; P$2 3.2,-0.1
M1 = smd 1.778 x 0.914: 1 0,0; 2 0,-1.27; 3 0,-2.54; 4 0,-3.81; 5 0,-5.08; 6 0,-6.35; 7 0,-7.62; 8 0,-8.89; 9 0,-10.16; 10 0,-11.43; 11 0,-12.7; 12 0,-13.97; 13 0,-15.24; 14 0,-16.51; 15 0,-17.78; 16 0,-19.05; 17 0,-20.32; 18 0,-21.59; 37 25.4,-21.59; 38 25.4,-20.32; 39 25.4,-19.05; 40 25.4,-17.78; 41 25.4,-16.51; 42 25.4,-15.24; 43 25.4,-13.97; 44 25.4,-12.7; 45 25.4,-11.43; 46 25.4,-10.16; 47 25.4,-8.89; 48 25.4,-7.62; 49 25.4,-6.35; 50 25.4,-5.08; 51 25.4,-3.81; 52 25.4,-2.54; 53 25.4,-1.27; 54 25.4,0 | smd 0.914 x 1.778: 19 1.91,-23.5; 20 3.18,-23.5; 21 4.45,-23.5; 22 5.72,-23.5; 23 6.99,-23.5; 24 8.26,-23.5; 25 9.53,-23.5; 26 10.8,-23.5; 27 12.07,-23.5; 28 13.34,-23.5; 29 14.61,-23.5; 30 15.88,-23.5; 31 17.15,-23.5; 32 18.42,-23.5; 33 19.69,-23.5; 34 20.96,-23.5; 35 22.23,-23.5; 36 23.5,-23.5; 55 23.49,2; 56 22.22,2; 57 20.95,2; 58 19.68,2; 59 18.41,2; 60 17.14,2; 61 15.87,2; 62 14.6,2; 63 13.33,2; 64 12.06,2; 65 10.79,2; 66 9.52,2; 67 8.25,2; 68 6.98,2; 69 5.71,2; 70 4.44,2; 71 3.17,2; 72 1.9,2
SOT23-3 = smd 0.8 x 0.9: 1 -0.95,-1; 2 0.95,-1; 3 0,1.1
TC-020X = drill 0.9 pad 1.778: 1 -2.21,0.11; 2 2.31,0.11 | drill 1.2 pad 2.54: 3 -4.25,-2.4; 4 4.35,-2.4
SMD-BUZZER1 = smd 3 x 2: + 4.5,0; - -4.5,0
PAD.03X.05 = smd 1.27 x 1.27: P$1 0,0
SOP63P599X175-20N = smd 1.97 x 0.41: 1 -2.47,2.857; 2 -2.47,2.223; 3 -2.47,1.587; 4 -2.47,0.953; 5 -2.47,0.318; 6 -2.47,-0.318; 7 -2.47,-0.953; 8 -2.47,-1.587; 9 -2.47,-2.223; 10 -2.47,-2.857; 11 2.47,-2.857; 12 2.47,-2.223; 13 2.47,-1.587; 14 2.47,-0.953; 15 2.47,-0.318; 16 2.47,0.318; 17 2.47,0.953; 18 2.47,1.587; 19 2.47,2.223; 20 2.47,2.857
ESP-WROOM-32 = smd 1.5 x 1: 1 -9.25,7; 2 -9.25,5.73; 3 -9.25,4.46; 4 -9.25,3.19; 5 -9.25,1.92; 6 -9.25,0.65; 7 -9.25,-0.62; 8 -9.25,-1.89; 9 -9.25,-3.16; 10 -9.25,-4.43; 11 -9.25,-5.7; 12 -9.25,-6.97; 13 -9.25,-8.24; 14 -9.25,-9.51; 25 9.25,-9.51; 26 9.25,-8.24; 27 9.25,-6.97; 28 9.25,-5.7; 29 9.25,-4.43; 30 9.25,-3.16; 31 9.25,-1.89; 32 9.25,-0.62; 33 9.25,0.65; 34 9.25,1.92; 35 9.25,3.19; 36 9.25,4.46; 37 9.25,5.73; 38 9.25,7 | smd 1 x 1.5: 15 -5.7,-11.25; 16 -4.43,-11.25; 17 -3.16,-11.25; 18 -1.89,-11.25; 19 -0.62,-11.25; 20 0.65,-11.25; 21 1.92,-11.25; 22 3.19,-11.25; 23 4.46,-11.25; 24 5.73,-11.25 | smd 6 x 6: GND 0.3,-0.7
TSOT-23-8 = smd 0.4 x 1.22: 1 -0.975,-1.31; 2 -0.325,-1.31; 3 0.325,-1.31; 4 0.975,-1.31; 5 0.975,1.31; 6 0.325,1.31; 7 -0.325,1.31; 8 -0.975,1.31
TSSOP20-0.65-6.5X4.4MM = smd 0.35 x 1.5: 1 -2.925,-3.065; 2 -2.275,-3.065; 3 -1.625,-3.065; 4 -0.975,-3.065; 5 -0.325,-3.065; 6 0.325,-3.065; 7 0.975,-3.065; 8 1.625,-3.065; 9 2.275,-3.065; 10 2.925,-3.065; 11 2.91,3.065; 12 2.26,3.065; 13 1.61,3.065; 14 0.96,3.065; 15 0.325,3.065; 16 -0.325,3.065; 17 -0.975,3.065; 18 -1.625,3.065; 19 -2.275,3.065; 20 -2.925,3.065
SOT23-5 = smd 0.55 x 1.2: 1 -0.95,-1.3; 2 0,-1.3; 3 0.95,-1.3; 4 0.95,1.3; 5 -0.95,1.3
JST5PIN = drill 1 pad 1.676: 1 0,5; 2 0,2.5; 3 0,0; 4 0,-2.5; 5 0,-5
MICRO-USB5+6P-SMD-0.65-AB = smd 0.4 x 1.35: 1 -1.3,2.875; 2 -0.65,2.875; 3 0,2.875; 4 0.65,2.875; 5 1.3,2.875 | smd 1.9 x 1.9: P1 -1.2,0; P2 1.2,0 | drill 0.508 pad 1.016 long: P3 -3.625,0; P4 3.625,0 | drill 0.8: P5 -2.425,2.73; P6 2.425,2.73

### Placement (x,y rotation side)
BT1  31.12,7.62 90 top
C1  80.9,17.14 90 top
C2  86.11,11.3 270 top
C3  84.46,11.3 270 top
C4  81.41,9.02 0 top
C5  75.69,5.97 180 top
C6  75.69,4.32 180 top
C7  82.55,17.14 90 top
C8  91.06,10.79 90 top
C9  34.67,57.66 270 top
C10  34.67,61.09 90 top
C11  9.78,3.3 180 top
C12  74.68,10.54 0 top
C13  92.07,33.02 180 bottom
C14  44.07,17.65 180 top
C15  65.41,38.1 270 top
C16  19.56,27.3 0 top
C17  60.71,64.77 90 top
C18  60.71,57.91 270 top
C19  56.26,51.94 270 top
C20  49.53,51.94 270 top
C21  25.4,36.58 0 top
C22  77.6,15.75 180 top
D2  103.63,67.94 270 top
D3  103.63,62.86 270 top
IC1  69.34,37.85 0 top
IC2  89.28,36.58 90 bottom
IC3  23.37,20.95 270 top
IC4  25.91,31.5 0 top
J1  8.51,54.1 270 top
J5  85.6,57.53 270 bottom
J6  99.19,30.61 180 bottom
J7  85.6,29.46 0 bottom
J8  99.19,10.92 0 top
J9  107.06,42.04 90 top
J10  46.48,15.11 270 top
J11  49.4,58.8 180 top
L1  83.57,3.3 180 top
MCU1  56.39,46.86 270 top
Q1  20.7,48.26 0 top
Q2  20.7,53.47 0 top
Q3  58.04,5.59 180 top
Q5  80.52,39.62 270 top
R1  17.02,48.26 270 top
R2  17.02,53.47 90 top
R3  98.43,53.47 180 top
R4  98.43,51.31 180 top
R5  58.93,9.27 270 top
R6  57.15,9.27 90 top
R7  60.71,61.34 90 top
R8  80.9,43.43 180 top
R9  47.75,17.65 180 top
R10  92.84,55.63 270 top
R11  90.3,55.63 270 top
R12  60.71,53.09 90 top
R13  60.71,49.78 90 top
R14  76.96,40.64 0 top
R15  76.96,38.73 180 top
R16  84.2,17.14 90 top
R17  79.38,13.34 90 top
R18  77.6,17.4 180 top
R19  78.99,34.54 0 bottom
R20  78.99,36.45 0 bottom
R21  78.99,38.35 0 bottom
R22  78.99,40.26 0 bottom
R23  98.43,37.08 0 bottom
R24  98.43,24.13 180 bottom
R25  93.6,29.08 270 bottom
S1  18.92,68.07 0 top
SP1  67.06,6.1 0 top
TP1  74.93,60.33 0 bottom
TP2  79.38,58.67 0 bottom
TP3  77.6,56.13 0 bottom
TP4  79.38,54.61 0 bottom
TP5  77.6,53.34 0 bottom
TP6  79.38,52.07 0 bottom
TP7  77.6,50.8 0 bottom
TP8  79.38,49.66 0 bottom
TP9  77.6,48.39 0 bottom
TP10  74.42,48.39 0 bottom
TP11  72.14,48.39 0 bottom
TP13  66.8,49.02 0 bottom
TP14  30.99,22.23 0 bottom
TP16  40.64,19.05 0 bottom
TP17  43.31,19.05 0 bottom
U1  28.45,59.56 90 top
U2  72.52,56.52 0 top
U3  82.04,12.19 0 top
U5  45.72,33.02 0 bottom
U6  53.34,51.82 270 top
U$2  92.84,61.72 90 top
USB1  29.97,69.47 180 top

### Tracks (layer width: path | path; a pad name or v marks a point on that pad's centre or on a via)
1.8V  (via drill 0.35)
  Top 0.406: MCU1.53 v55.12,19.56 | v41.66,31.5 v39.62,31.5
  Bottom 0.203: 60.2,13.59 60.13,13.53
  Bottom 0.305: U5.10 42.79,31.5 | 42.79,31.5 47.62,31.5 48.01,31.12 48.01,29.97 U5.2 | v41.66,31.5 42.79,31.5
  Bottom 0.406: v55.12,19.56 55.12,16.76 56.13,15.75 59.05,15.75 60.2,14.61 60.2,13.59 | 60.13,13.53 59.05,12.45 50.29,12.45 48.9,13.84 48.9,21.21 48.01,22.1 40.39,22.1 39.62,22.86 v39.62,31.5
+3V3  (via drill 0.35)
  Top 0.305: C16.1 18.71,28.61 19.43,29.34 v19.94,29.34 | v19.94,32.51 21.69,32.51 22.1,32.92 IC4.14 22.1,35.31 23.37,36.58 C21.1
  Top 0.406: v37.72,61.72 35.94,59.94 34.67,59.94 | U1.14 29.4,60.64 v30.1,59.94 | v30.1,59.94 34.67,59.94 | U1.3 26.86,59.88 v26.92,59.94 | J1.14 14.6,38.86 v20.83,45.09 | U1.13 30.03,60.01 v30.1,59.94 | C10.1 34.67,59.94 | C11.1 10.67,3.34 10.67,5.46 J1.40 12.32,5.84 13.34,6.86 13.34,10.03 14.99,11.68 14.99,22.73 16.38,24.13 IC3.2 16.42,24.13 16.42,26.29 17.44,27.3 C16.1 | R11.2 R10.2 94.65,54.78 95.38,55.5 95.38,61.68 U$2.4 | v45.47,13.34 45.43,13.37 J10.4 45.43,17.65 C14.1 R9.2 | IC1.8 67.44,39.62 66.76,38.95 C15.1 62.01,38.95 v61.98,38.99 | v55.75,7.11 55.75,4.06 56.51,3.3 64.44,3.3 67.24,6.1 SP1.+ | v55.24,38.99 v48.01,38.99
  Top 0.813: MCU1.54 v56.39,19.56 v56.39,18.54
  Bottom 0.203: 95.25,37.85 90.55,37.85 | 48.01,36.1 U5.19
  Bottom 0.305: v19.94,32.51 v19.94,29.34 | v48.01,38.99 48.01,36.1
  Bottom 0.406: v30.1,59.94 v26.92,59.94 22.73,59.94 20.83,58.04 v20.83,45.09 | v45.47,13.34 47.24,13.34 49.4,11.18 49.4,7.11 | v61.98,38.99 v55.24,38.99 | R22.2 75.56,40.26 75.44,40.39 | R21.2 75.44,38.35 | R20.2 75.44,36.45 | R19.2 75.44,34.54 | 62.23,20.7 89.28,20.7 90.55,21.97 90.55,31.37 91.22,32.04 C13.1 91.19,33.06 91.19,34.67 | IC2.8 91.19,34.67 | 91.19,34.67 90.55,35.31 90.55,37.85 | 95.25,37.85 95.67,37.85 96.43,37.08 R23.2 | J11.1 38.74,57.53 37.72,58.55 v37.72,61.72
  Bottom 1.016: v56.39,18.54 v56.39,19.56 56.39,20.7 | 55.24,41.66 55.24,53.72 | 55.24,41.66 v55.24,38.99 55.24,20.7 56.39,20.7 | 55.24,53.72 64.13,62.61 85.47,62.61 87.38,64.52 94.36,64.52 95.34,63.54 U$2.4 | 56.39,20.7 62.23,20.7 62.23,8.89 60.45,7.11 v55.75,7.11 49.4,7.11 35.31,7.11 34.04,5.84 J1.40 | 55.24,41.66 74.17,41.66 75.44,40.39 75.44,38.35 75.44,36.45 75.44,34.54 J7.10 J7.12 | 55.24,53.72 53.98,54.99 45.34,54.99 44.32,56.01 J11.1
+5V  (via drill 0.35)
  Top 0.152: C9.1 34.58,58.51 34.29,58.8
  Top 0.305: 75.93,15.88 75.69,15.88 75.69,17.4 | U6.3 52.89,50.87 v53.34,50.42
  Top 0.406: MCU1.51 53.21,21.46 MCU1.52 | USB1.1 31.27,65.5 31.75,65.02 v33.91,65.02 | U1.15 28.77,59.63 29.59,58.8 34.29,58.8 v35.94,58.8 | R18.2 75.69,17.4
  Top 0.508: MCU1.51 52.58,20.19 v53.21,19.56 53.85,20.19 MCU1.52 | v47.12,52.83 v48.13,52.83 49.49,52.83 C20.1 49.56,52.77 U6.1
  Top 1.016: 76.58,3.05 76.54,3.09 C6.1 | C22.2 76.62,15.88 75.93,15.88
  Top 1.27: 53.21,21.46 53.21,20.57 | v53.21,19.56 v53.21,18.54 v53.21,17.53 | v33.91,65.02 v34.92,65.02 v35.94,65.02 | J5.4 88.9,49.91 | 88.9,49.91 91.69,49.91 97.84,56.05 U$2.5 | L1.P$2 80.01,3.05 76.58,3.05 | 76.58,3.05 76.58,4.28 C6.1 | C6.1 76.54,5.08 | 76.54,5.08 C5.1 | C5.1 76.54,7.79 | 76.54,7.79 75.93,8.4 75.93,8.91 75.93,9.27 | C5.1 78.36,5.97 | 80.37,4.47 80.37,3.96 | 80.37,3.96 L1.P$2 | 78.36,5.97 79.18,5.14 | 79.18,5.14 80.01,4.32 | 76.54,5.08 79.12,5.08 79.18,5.14 | C6.1 80.01,4.32 | 80.01,4.32 80.37,3.96 | 76.58,3.05 76.58,2.29 80.39,2.29 80.39,3.38 L1.P$2 | 76.54,7.79 78.36,5.97 | 75.93,15.88 75.93,18.52 77.85,20.45 86.61,20.45 88.9,22.73 88.9,49.91
  Top 2.032: C12.1 75.93,15.88 75.93,16.51 59.56,16.51 59.53,16.48 54.26,16.48 v53.21,17.53 v53.21,19.56 53.21,20.57 | C12.1 75.93,9.27 | 80.37,4.47 75.93,8.91 C12.1
  Bottom 0.305: D2.A 99.91,69.22 97.84,67.48 U$2.5 | v53.34,50.42 53.28,50.35 51.24,50.35
  Bottom 1.27: v53.21,17.53 v53.21,18.54 v53.21,19.56 53.21,48.39 51.24,50.35 48.77,52.83 v48.13,52.83 v47.12,52.83 37.72,52.83 35.94,54.61 v35.94,58.8 v35.94,65.02 v34.92,65.02 v33.91,65.02
A
  Bottom 0.406: R23.1 99.28,35.43 | 99.28,35.43 99.28,33.2 J6.2 96.01,29.93 R25.1 | IC2.6 94.74,37.21 96.52,35.43 99.28,35.43
B
  Bottom 0.406: R24.2 99.19,24.22 J6.1 93.72,28.11 | 93.72,28.11 R25.2 | IC2.7 94.74,35.94 95.88,34.8 95.88,32 95,31.12 92.58,31.12 92.2,30.73 92.2,28.45 92.54,28.11 93.72,28.11
BOOT  (via drill 0.35)
  Top 0.406: MCU1.17 36.07,48.39 35.56,48.9 26.29,48.9 v23.88,46.48 | v23.88,54.61 23.83,54.57 Q2.3
  Bottom 0.406: v23.88,46.48 v23.88,54.61
BUZZER  (via drill 0.35)
  Top 0.406: MCU1.38 36.07,19.56 37.34,18.29 v42.04,18.29 | R5.1 R6.2 57.11,10.16 v52.45,10.16
  Bottom 0.406: v42.04,18.29 45.34,14.99 46.61,14.99 51.43,10.16 v52.45,10.16
DTR#
  Top 0.305: U1.1 25.59,53.16 24.9,52.47 Q2.2 21.65,50.93 18.8,50.93 17.02,49.15 R1.1
ESP32_GPIO0  (via drill 0.35)
  Top 0.305: U2.25 78.72,47.01 77.34,48.39 v77.34,57.53
  Top 0.406: R8.1 81.75,46.99 U2.25
  Bottom 0.305: v77.34,57.53 J5.1
ESP32_GPIO2  (via drill 0.35)
  Top 0.254: U2.24 78.25,46.21 v76.07,48.39
  Bottom 0.254: v76.07,48.39 TP10.P$1
ESP32_GPIO4  (via drill 0.35)
  Top 0.254: U2.26 81.75,48.26 v80.26,48.26
  Bottom 0.254: v80.26,48.26 77.72,48.26 TP9.P$1
ESP32_GPIO5  (via drill 0.35)
  Top 0.254: U2.29 78.12,52.09 v78.1,52.07
  Bottom 0.254: v78.1,52.07 TP6.P$1
ESP32_GPIO12  (via drill 0.35)
  Top 0.305: v91.57,52.07 90.68,51.18 84.33,51.18 83.06,49.91 83.06,42.42 82.55,41.91 76.7,41.91 75.69,42.93 65.53,42.93 63.27,45.19 U2.14
  Bottom 0.305: D3.A 101.73,64.14 100.71,63.12 100.71,59.69 93.09,52.07 v91.57,52.07
ESP32_GPIO14  (via drill 0.35)
  Top 0.254: U2.13 64.5,48.27 64.52,48.26 v64.64,48.26
  Bottom 0.254: v64.64,48.26 66.04,48.26 TP13.P$1
ESP32_GPIO15  (via drill 0.35)
  Top 0.254: U2.23 76.98,46.47 75.95,47.5 75.31,47.5 74.42,48.39 v74.42,49.91
  Bottom 0.254: v74.42,49.91 72.77,49.91 72.14,49.28 TP11.P$1
ESP32_GPIO16  (via drill 0.35)
  Top 0.254: U2.27 78.12,49.55 v78.1,49.53
  Bottom 0.254: v78.1,49.53 78.23,49.66 TP8.P$1
ESP32_GPIO17  (via drill 0.35)
  Top 0.254: U2.28 81.75,50.8 v80.26,50.8
  Bottom 0.254: v80.26,50.8 TP7.P$1
ESP32_GPIO18  (via drill 0.35)
  Top 0.254: U2.30 81.75,53.34 v80.26,53.34
  Bottom 0.254: v80.26,53.34 TP5.P$1
ESP32_GPIO19  (via drill 0.35)
  Top 0.254: U2.31 77.99,54.62 77.98,54.61 v78.03,54.61
  Bottom 0.254: v78.03,54.61 TP4.P$1
ESP32_GPIO21  (via drill 0.35)
  Top 0.254: U2.33 80.15,57.17 v79.12,56.13
  Bottom 0.254: v79.12,56.13 TP3.P$1
ESP32_GPIO22  (via drill 0.35)
  Top 0.254: U2.36 78.37,60.97 77.72,60.33 v77.72,58.67
  Bottom 0.254: v77.72,58.67 TP2.P$1
ESP32_GPIO23  (via drill 0.35)
  Top 0.254: U2.37 76.98,62.25 v76.07,61.34
  Bottom 0.254: v76.07,61.34 75.06,60.33 TP1.P$1
ESP32_RESET
  Top 0.305: R15.2 R14.1 76.11,41.66 75.35,42.42 65.02,42.42 60.58,46.86 MCU1.1
ESP32_RST  (via drill 0.35)
  Top 0.305: v64.9,54.61 64.9,60.45 64.37,60.97 U2.3 | J5.5 84.2,47.37 83.57,46.74 83.57,41.4 81.79,39.62 Q5.3
  Top 0.406: U2.3 62.08,60.97 61.6,60.49 R7.1 C18.1
  Bottom 0.305: v64.9,54.61 67.94,54.61 68.83,53.72 68.83,47.88 69.34,47.37 J5.5
ESP32_RX
  Top 0.305: U2.34 82.92,58.44 83.31,58.04 83.31,52.96 83.82,52.45 J5.3
ESP32_TX
  Top 0.305: U2.35 83.55,59.7 83.95,59.31 83.95,55.37 84.33,54.99 J5.2
GND  (via drill 0.35, 3.81)
  Top 0.305: R15.1 77.87,38.67 Q5.2 79.65,38.55 81.25,38.55 81.49,38.31 | 85.6,41.66 J5.6 | C18.2 v60.71,55.75 | R3.1 100.2,53.47 | R4.1 100.08,51.31 100.2,51.18 | Q3.2 57.09,5.9 57.4,5.59 59.69,5.59 60.2,6.1 60.2,14.1 | IC4.7 29.72,27.18 29.22,26.68 v28.44,26.68 | C21.2 v27.43,36.58
  Top 0.406: U1.6 28.77,58.61 28.13,59.25 U1.16 28.13,64.04 27.91,64.26 | 28.67,65.02 USB1.5 28.67,67.53 29.08,67.94 v35.94,67.94 | J1.11 5.21,41.4 | C9.2 34.67,55.12 34.16,54.61 v33.4,54.61 | C10.2 33.23,61.94 v32.7,61.4 | J1.39 8.93,5.42 C11.2 8.93,2.37 9.52,1.78 14.86,1.78 16.13,3.05 16.13,7.62 | Q3.2 57.19,6.69 57.15,6.73 R6.1 | C17.2 60.83,65.62 61.85,64.6 61.85,63.88 62.21,63.52 U2.1 | J10.6 C14.2 43.22,18.84 43.94,19.56 v50.67,19.56 | IC1.7 68.71,37.34 | 68.71,37.34 IC1.2 | 68.71,37.34 69.98,37.34 | 69.98,37.34 71.25,37.34 | 71.25,37.34 77.34,37.34 77.87,37.87 77.87,38.67 | C15.2 67.44,37.25 | 67.44,37.25 68.62,37.25 68.71,37.34 | IC1.1 67.44,37.25 | IC1.3 69.98,37.34 | IC1.4 71.25,37.34 | IC3.5 23.11,20.32 | 23.11,20.32 IC3.12 | IC3.13 23.11,21.59 | 23.11,20.32 23.11,21.59 | IC3.11 23.11,19.05 | IC3.6 23.11,19.05 | IC3.7 23.11,17.78 | 23.11,17.78 IC3.10 | 23.11,16.51 IC3.8 17.02,16.51 16.13,15.62 16.13,7.62 | 23.11,16.51 IC3.9 | 23.11,20.32 23.11,19.05 | 23.11,19.05 23.11,17.78 | 23.11,17.78 23.11,16.51 | C16.2 23.11,24.6 23.11,21.59 | BT1.- 16.13,7.62 | 89.28,9.54 85.72,9.54 | 85.09,9.54 83.82,9.54 | 83.82,9.54 83.7,9.54 | 89.28,9.54 89.92,9.54 | 83.02,10.22 83.39,9.85 | 83.39,9.85 83.7,9.54 | 83.34,10.56 83.45,10.45 | 83.45,10.45 83.95,10.45 | 83.95,10.45 C3.2 | U3.4 83.02,10.22 | U3.4 83.34,10.56 | 83.45,10.45 83.59,10.31 | 83.59,10.31 83.87,10.03 | 83.87,10.03 89.15,10.03 89.28,9.91 | 89.28,9.91 89.28,9.54 | 83.45,10.45 83.22,10.22 83.02,10.22 | 83.39,9.85 83.59,10.06 83.59,10.31 | 83.7,9.54 83.7,9.67 | 83.87,10.03 83.7,9.86 83.7,9.67 | 83.82,9.54 83.7,9.67 | 83.82,9.54 84.18,9.91 89.28,9.91 | C3.2 84.5,10.4 C2.2 | 83.95,10.45 83.69,10.71 83.69,10.92
  Top 0.406: 83.69,10.92 83.69,11.05 | 83.44,11.18 83.57,11.18 83.69,11.05 | 83.44,11.18 83.02,11.18 U3.4 | 83.57,11.05 83.69,10.92 | 83.44,11.18 83.57,11.05 | 83.34,10.56 83.34,10.82 83.57,11.05 | 83.82,9.54 84.94,8.42 | 84.94,8.42 85.48,8.42 | 83.7,9.54 84.82,8.42 84.94,8.42 | 83.69,11.05 84.29,10.45 C3.2 | R17.1 79.38,11.3 v79.25,11.18 | v79.25,11.18 79.25,10.67 | 79.25,10.67 v79.25,10.16 | v79.25,10.16 v80.26,10.16 | v80.26,10.16 v80.26,11.18 | v79.25,11.18 v80.26,11.18 | U3.1 81.07,11.13 81.03,11.18 v80.26,11.18 | U3.1 81.07,10.54 | 81.07,10.54 81.07,10.16 v80.26,10.16 | U3.1 79.46,10.88 79.25,10.67 | v79.25,10.16 79.63,10.54 81.07,10.54 | C7.2 C1.2 79.79,18 v79.76,18.03 | S1.2 21.23,62.97 21.34,62.86
  Top 0.508: MCU1.49 50.04,20.19 v50.67,19.56 51.31,20.19 MCU1.50 | 48.13,51.09 47.5,51.09 v47.5,51.05 v48.13,50.42 | 48.13,51.09 48.77,51.09 | 48.77,51.09 C20.2 50.43,51.09 51.15,51.82 U6.2 55.41,51.82 56.13,51.09 C19.2 | v48.13,50.42 48.13,51.09 | v48.13,50.42 48.13,50.46 48.77,51.09
  Top 0.61: 99.34,42.06 J9.GND
  Top 0.813: 11.05,57.02 11.05,61.47 12.45,62.86 21.34,62.86 23.95,62.86 25.34,64.26 v25.91,64.26 | 11.05,57.02 J1.2 | 11.05,57.02 6.86,57.02 5.21,55.37 5.21,41.4 5.21,6.73 6.1,5.84 J1.39 | MCU1.49 50.67,21.46 MCU1.50 | MCU1.72 53.35,44.96 v50.67,42.29 | U2.1 69.58,63.52 72.82,60.28 | 72.82,60.28 U2.GND 66.82,49.81 U2.15 | 72.82,60.28 76.05,63.52 U2.38 87.84,63.52 U$2.1
  Top 1.016: 28.67,65.02 27.91,64.26 v27.69,64.26 v26.8,64.26 v25.91,64.26 | C3.2 86.06,10.45 C2.2 89.06,10.4 89.92,9.54 C8.2 | C8.2 98.06,9.54 J8.2 | 83.87,10.03 84.99,8.91 | 84.99,8.91 85.48,8.42 J8.2 | 85.09,9.54 85.72,9.54 C8.2 | J8.2 98.13,8.42 97.64,8.91 84.99,8.91 | J5.6 85.57,44.81 85.57,40.65 83.23,38.31 81.49,38.31 77.85,34.67 v73.79,34.67 v72.77,34.67
  Top 1.27: 50.67,21.46 v50.67,19.56 v50.67,18.54 v50.67,17.53 | 87.84,63.52 89.6,65.28 98.04,65.28 100.2,63.12 100.2,53.47 100.2,51.18 100.2,42.93 99.34,42.06 | C12.2 73.41,10.52 73.41,8.51 74.84,7.07 C5.2 C6.2 74.84,3.21 v74.8,3.17 v74.8,2.29
  Top 2.032: v56.51,14.1 v57.53,14.1 v58.55,14.1 60.2,14.1 71.1,14.1 73.41,11.79 73.41,10.52
  Bottom 0.305: v60.71,55.75 v72.77,55.75 | v28.44,26.68 v28.45,26.67 | U5.11 42.81,39.25 43.69,40.13 50.67,40.13
  Bottom 0.406: v35.94,67.94 40.64,67.94 44.32,64.26 J11.2
  Bottom 0.813: U$2.1 87.84,45.67 87,44.83 J5.6
  Bottom 1.016: J7.11 71.88,29.46 71.3,30.05 71.3,32.94 73.03,34.67 v73.79,34.67
  Bottom 1.27: 27.43,62.36 31.75,62.36 v32.7,61.4 33.4,60.71 v33.4,54.61 33.4,53.85 36.2,51.05 v47.5,51.05 v48.13,50.42 50.67,47.88 v50.67,42.29 50.67,40.13 v50.67,19.56 v50.67,18.54 v50.67,17.53 50.67,14.1 v56.51,14.1 v57.53,14.1 v58.55,14.1 | 27.43,62.36 26.42,62.36 | 26.42,62.36 25.91,62.86 v25.91,64.26 v26.8,64.26 | v72.77,55.75 77.34,60.33 87.84,60.33 U$2.1 | v26.8,64.26 v27.69,64.26 27.69,62.61 27.43,62.36 | v26.8,64.26 26.8,62.74 26.42,62.36
  other vias: 85.47,9.4 85.47,8.51 86.49,9.4 86.49,8.51 87.5,8.51 87.5,9.4 88.52,9.4 88.52,8.51 83.57,3.3 82.68,3.3 82.68,4.19 83.57,4.19 84.46,4.19 84.46,3.3 84.46,2.41 84.46,1.52 83.57,1.52 83.57,2.41 82.68,2.41 82.68,1.52 82.68,5.08 83.57,5.08 84.46,5.08 64.26,14.1 65.28,14.1 66.29,14.1 67.31,14.1 68.33,14.1
  pour Bottom: -0.13,71.25 107.19,71.25 107.19,-0.13 -0.13,-0.13
I2C0_SCL
  Top 0.305: J1.32 12.57,16 13.34,16.76 13.34,26.29 18.28,31.24 30.09,31.24 31.62,29.71 MCU1.31
I2C0_SDA
  Top 0.305: J1.33 9.78,14.73 13.34,14.73 14.22,15.62 14.22,26.16 18.54,30.48 29.84,30.48 31.87,28.44 MCU1.32
I2C1_SCL  (via drill 0.35)
  Top 0.406: v56.64,27.18 v56.64,27.17 MCU1.33 31.62,27.17 29.84,25.4 IC3.16 | R10.1 U$2.3 | IC1.6 v69.98,38.61
  Bottom 0.305: 89.03,58.29 89.03,62.74 89.66,63.37 92.46,63.37 92.84,62.99 U$2.3
  Bottom 0.406: 69.98,27.18 87.38,27.18 89.03,28.83 89.03,58.29 | 69.98,27.18 v56.64,27.18 | v69.98,38.61 69.98,27.18
I2C1_SDA  (via drill 0.35)
  Top 0.406: v56.64,25.91 v56.64,25.9 MCU1.34 31.62,25.9 29.84,24.13 IC3.15 | R11.1 90.3,61.68 U$2.2 | IC1.5 v71.25,38.61 | v64.64,28.07 v64.64,25.91
  Bottom 0.406: U$2.2 89.83,61.21 89.83,27.6 88.14,25.91 v64.64,25.91 v56.64,25.91 | v71.25,38.61 71.25,39.75 70.74,40.26 65.53,40.26 64.64,39.37 v64.64,28.07
IO8
  Top 0.305: MCU1.9 46.23,53.34 46.74,53.85 54.61,53.85 55.24,54.48 55.24,55.5 55.75,56.01 55.75,58.8 J11.10
IO9
  Top 0.305: MCU1.10 44.96,53.47 45.85,54.36 53.59,54.36 54.48,55.24 J11.9
IO10
  Top 0.305: MCU1.11 43.69,53.85 44.7,54.86 52.32,54.86 53.21,55.75 53.21,58.8 J11.8
IO11
  Top 0.305: J11.7 51.94,56.26 51.05,55.37 43.31,55.37 42.42,54.48 MCU1.12
IO12
  Top 0.305: MCU1.13 41.15,54.36 42.67,55.88 50.04,55.88 50.67,56.52 50.67,58.8 J11.6
IO13
  Top 0.305: J11.5 48.26,56.39 41.66,56.39 39.88,54.61 MCU1.14
IO14
  Top 0.305: J11.4 45.59,61.34 40.39,61.34 38.61,59.56 MCU1.15
IO15
  Top 0.305: J11.3 48.13,58.8 48.13,60.96 47.24,61.85 39.75,61.85 37.34,59.44 MCU1.16
IO24
  Top 0.305: MCU1.25 29.08,37.33 28.45,36.7 IC4.9
IO40  (via drill 0.35)
  Top 0.305: v42.93,33.66 42.93,31.62 42.93,31.37 44.32,29.97 v56.51,29.97 | v62.36,28.07 62.36,25.02 63.12,24.26 84.58,24.26 85.6,25.27 J7.1
  Bottom 0.305: U5.12 43.46,34.95 42.93,34.42 v42.93,33.66 | v56.51,29.97 58.42,28.07 v62.36,28.07 | J7.1 84.07,27.94 82.3,27.94 81.79,28.45 81.79,34.67
  Bottom 0.406: IC2.1 81.79,34.67 79.97,34.67 R19.1
IO41  (via drill 0.35)
  Top 0.305: v44.2,37.85 46.1,35.94 56.51,35.94 v56.51,35.92 | v63.5,28.07 63.5,25.65 64.13,25.02 83.19,25.02 84.33,26.16 84.33,30.73 J7.2 85.6,33.78 v83.44,35.94
  Bottom 0.305: U5.13 44.11,37.68 44.07,37.72 v44.2,37.85 | v56.51,35.92 56.62,35.92 60.03,32.51 61.09,32.51 62.1,33.53 63.12,33.53 63.5,33.15 v63.5,28.07
  Bottom 0.406: IC2.2 v83.44,35.94 81.79,35.94 81.28,36.45 R20.1
IO42  (via drill 0.35)
  Top 0.305: v43.94,33.66 43.94,32 44.83,31.12 v56.51,31.12 | v60.58,28.96 61.6,28.96 62.46,29.83 65.81,29.83 66.29,29.34 66.29,26.42 66.8,25.91 82.3,25.91 83.06,26.67 J7.3 | v82.42,37.21 82.42,34.92 v84.33,33.02
  Bottom 0.305: U5.14 44.76,34.98 43.94,34.16 v43.94,33.66 | v56.51,31.12 58.67,28.96 v60.58,28.96 | v84.33,33.02 84.33,30.73 J7.3
  Bottom 0.406: IC2.3 v82.42,37.21 81.28,38.35 R21.1
IO43  (via drill 0.35)
  Top 0.305: v44.94,33.66 44.94,32.91 45.61,32.24 v56.51,32.24 | v60.58,29.95 61.47,29.95 61.98,30.46 66.82,30.46 67.06,30.23 67.06,27.05 67.56,26.54 80.65,26.54 81.79,27.69 81.79,30.73 J7.4
  Bottom 0.305: U5.15 45.4,34.85 44.96,34.42 44.96,33.66 v44.94,33.66 | v60.58,29.95 58.8,29.95 v56.51,32.24 | IC2.4 87.5,38.48 88.14,37.85 88.14,34.42 87.5,33.78 83.57,33.78 83.06,33.27 J7.4
  Bottom 0.406: IC2.4 83.31,38.48 81.53,40.26 R22.1
IO44  (via drill 0.35)
  Top 0.305: v45.97,33.66 v56.51,33.66 | v60.58,31.12 67.31,31.12 67.82,30.61 67.82,27.69 68.33,27.18 78.23,27.18 J7.5
  Bottom 0.305: U5.16 46.04,33.73 v45.97,33.66 | v56.51,33.66 59.05,31.12 v60.58,31.12
IO45  (via drill 0.35)
  Top 0.305: v56.51,34.92 48.26,34.92 v47.75,34.42 | v62.61,32.51 68.07,32.51 70.74,29.84 v70.74,28.7
  Bottom 0.305: U5.17 46.7,34.8 47.08,34.42 v47.75,34.42 | v62.61,32.51 61.98,31.88 59.56,31.88 v56.51,34.92 | v70.74,28.7 71.63,27.81 78.74,27.81 79.25,28.32 79.25,30.73 J7.6
IO46  (via drill 0.35)
  Top 0.305: v46.99,37.85 47.88,36.96 v56.51,36.96 | v60.58,33.4 62.23,31.75 67.82,31.75 68.83,30.73 68.83,28.32 69.34,27.81 76.33,27.81 J7.7
  Bottom 0.305: U5.18 47.35,37.49 v46.99,37.85 | v60.58,33.4 57.02,36.96 v56.51,36.96
IO47  (via drill 0.35)
  Top 0.305: v56.51,37.97 v49.28,37.97 | v60.58,34.54 63.88,34.54 65.28,33.15 68.33,33.15 70.74,30.73 76.71,30.73 J7.8
  Bottom 0.305: U5.20 48.65,37.34 v49.28,37.97 | v60.58,34.54 57.15,37.97 v56.51,37.97
IOA38  (via drill 0.35)
  Top 0.254: MCU1.39 37.34,20.07 38.35,19.05 v39.24,19.05
  Bottom 0.254: TP16.P$1 v39.24,19.05
IOA39  (via drill 0.35)
  Top 0.254: MCU1.40 38.61,20.19 38.99,19.81 v42.42,19.81
  Bottom 0.254: TP17.P$1 43.18,19.05 v42.42,19.81
IOA40  (via drill 0.35)
  Top 0.305: MCU1.41 39.88,23.11 v41.78,25.02
  Bottom 0.305: v41.78,25.02 41.78,26.92 43.45,28.59 U5.9
IOA41  (via drill 0.35)
  Top 0.305: MCU1.42 41.15,22.73 42.8,24.38 v42.8,25.02
  Bottom 0.305: v42.8,25.02 42.8,26.67 44.1,27.97 U5.8
IOA42  (via drill 0.35)
  Top 0.305: MCU1.43 42.42,22.99 43.82,24.38 v43.82,25.02
  Bottom 0.305: v43.82,25.02 43.82,26.67 44.74,27.6 U5.7
IOA43  (via drill 0.35)
  Top 0.305: MCU1.44 43.69,23.24 44.83,24.38 v44.83,25.02
  Bottom 0.305: v44.83,25.02 44.83,26.54 45.4,27.11 U5.6
IOA44  (via drill 0.35)
  Top 0.305: MCU1.45 44.96,23.37 45.85,24.26 v45.85,25.02
  Bottom 0.305: v45.85,25.02 45.85,26.42 46.04,26.61 U5.5
IOA45  (via drill 0.35)
  Top 0.305: MCU1.46 46.23,23.62 46.99,24.38 v46.99,25.02
  Bottom 0.305: U5.4 46.7,25.31 v46.99,25.02
IOA46  (via drill 0.35)
  Top 0.305: v48.13,25.02 48.13,24.51 47.5,23.88 MCU1.47
  Bottom 0.305: v48.13,25.02 48.13,25.27 47.35,26.06 U5.3
IOA47  (via drill 0.35)
  Top 0.305: v49.4,24.89 48.64,24.13 48.64,21.59 MCU1.48
  Bottom 0.305: v49.4,24.89 49.4,26.29 48.64,27.05 U5.1
ISP_RX  (via drill 0.35)
  Top 0.305: U1.20 25.59,58.99 v25.53,58.93 | v48.64,43.81 50.55,43.81 51.31,44.58 MCU1.5
  Bottom 0.305: v25.53,58.93 25.53,47.88 26.42,46.99 32.51,46.99 35.69,43.81 v48.64,43.81
ISP_TX  (via drill 0.35)
  Top 0.305: U1.4 27.5,50.48 v28.19,49.78 | v48.64,44.83 49.66,44.83 50.04,45.21 MCU1.6
  Bottom 0.305: v48.64,44.83 36.2,44.83 31.24,49.78 v28.19,49.78
LCD_BL  (via drill 0.35)
  Top 0.406: MCU1.37 34.8,18.67 v34.04,17.91
  Bottom 0.406: v34.04,17.91 34.04,11.56 32.38,9.91 15.62,9.91 14.1,8.38 J1.38
LCD_D0  (via drill 0.35)
  Top 0.254: MCU1.36
  Top 0.305: MCU1.36 v32.89,20.7 | v6.73,32.51 6.73,36.7 7.62,37.59 9.78,37.59 J1.16
  Bottom 0.305: v32.89,20.7 32.89,31.12 31.62,32.38 22.1,32.38 20.32,34.16 14.22,34.16 12.57,32.51 v6.73,32.51
LCD_D1
  Top 0.305: MCU1.18 26.03,46.86 14.22,35.05 9.78,35.05 J1.17
LCD_D2
  Top 0.305: MCU1.19 25.27,44.95 14.1,33.78 J1.18
LCD_D3
  Top 0.305: MCU1.20 25.14,43.68 13.97,32.51 9.78,32.51 J1.19
LCD_D4
  Top 0.305: MCU1.21 24.89,42.41 13.72,31.24 J1.20
LCD_D5
  Top 0.305: MCU1.22 24.63,41.14 13.46,29.97 9.78,29.97 J1.21
LCD_D6
  Top 0.305: MCU1.23 24.38,39.87 13.21,28.7 J1.22
LCD_D7
  Top 0.305: MCU1.24 24.12,38.6 12.95,27.43 9.78,27.43 J1.23
LCD_RS  (via drill 0.35)
  Top 0.305: MCU1.26 v30.74,36.06 v30.73,36.07
  Bottom 0.305: v30.73,36.07 30.73,37.34 29.34,38.73 18.29,38.73 15.62,41.4 J1.12
LCD_WR  (via drill 0.35)
  Top 0.305: v29.72,36.58 IC4.8
  Bottom 0.305: v29.72,36.58 28.7,37.59 9.78,37.59 J1.13
N$1  (via drill 0.35)
  Top 0.406: USB1.3 29.97,64.39 v29.59,64.01 | v31.75,64.01 31.31,63.56 U1.11
  Bottom 0.406: v31.75,64.01 v29.59,64.01
N$2
  Top 0.406: USB1.2 30.62,63.52 30.67,63.47 U1.12
N$3
  Top 0.406: R2.2 18.96,54.32 19.81,53.47 19.81,52.53 Q2.1
N$4
  Top 0.406: Q1.1 17.17,47.26 R1.2
N$5
  Top 0.406: IC3.14 30.1,22.86 30.86,22.1 30.86,13.84 33.41,11.29 BT1.+
N$6
  Top 0.406: U3.7 81.72,14.55 80.9,15.37 C1.1
N$7  (via drill 0.35)
  Top 0.305: R3.2 96.43,52.32 v96.01,52.32
  Bottom 0.305: v96.01,52.32 95.38,52.32 95,51.94 95,50.8 95.38,50.42 97.03,50.42 98.55,51.94 98.55,55 103.75,60.2 105.16,60.2 106.3,61.34 106.3,65.41 105.03,66.67 D2.K
N$8  (via drill 0.35)
  Top 0.305: v96.01,51.31 R4.2
  Bottom 0.305: D3.K 103.63,61.34 97.79,55.5 97.79,52.2 96.9,51.31 v96.01,51.31
N$10
  Top 0.406: Q3.3 60.44,4.49 62.05,6.1 SP1.-
N$11
  Top 0.406: R5.2 58.99,8.36 Q3.1
N$12  (via drill 0.35)
  Top 0.406: C4.1 80.43,8.89 v79.38,8.89 | v83.48,14.73 83.02,14.27 U3.5
  Bottom 0.406: v79.38,8.89 82.55,8.89 83.44,9.78 83.44,14.73 v83.48,14.73
N$13
  Top 0.406: U3.3 82.37,9.58 82.42,9.52 82.3,9.4 82.26,9.36 C4.2
  Top 1.016: 84.33,6.86 86.77,4.42 L1.P$1 86.77,2.77 86.87,2.67 87.25,2.67 87.5,2.92 87.5,4.7 | 84.33,6.86 82.3,8.89 82.3,9.4 | 84.33,6.86 85.34,6.86 | 85.34,6.86 86.74,6.86 87.5,6.1 87.5,4.7 | 85.34,6.86 85.85,6.35 | 85.85,6.35 87.5,4.7 | C4.2 82.26,7.87 | 82.26,7.87 82.26,7.15 83.06,6.35 83.78,6.35 | 83.78,6.35 85.85,6.35 | 82.26,7.87 83.78,6.35
N$14
  Top 0.406: U3.8 81.07,14.18 R17.2 79.25,14.18 78.45,14.99 C22.1 R18.1
N$15
  Top 0.305: Q5.1 77.88,40.57 R14.2
PW-EN
  Top 0.406: U3.6 82.37,16.11 C7.1 R16.1
RST  (via drill 0.35)
  Top 0.406: v18.67,49.4 18.71,49.36 Q1.3 | MCU1.55 v49.41,23.37 v49.4,23.37
  Bottom 0.305: J1.15 9.75,35.08 13.08,35.08
  Bottom 0.406: 13.08,35.08 20.68,35.08 22.73,33.02 32,33.02 | 32.51,33.02 32.51,33.53 | 32.51,33.53 32.51,37.72 29.59,40.64 20.07,40.64 18.67,42.04 v18.67,49.4 18.67,66.23 S1.1 | v49.4,23.37 41.53,23.37 40.64,24.26 40.64,32 39.62,33.02 33.02,33.02 | 33.02,33.02 32.51,33.02 | 32.51,33.02 32,33.02 | 32,33.02 32.51,33.53 | 32.51,33.53 33.02,33.02
RTS#
  Top 0.254: 21.67,47.24 Q1.2
  Top 0.305: U1.2 26.23,50.35 23.13,47.26 Q1.2 | R2.1 17.02,51.44 15.75,50.16 15.75,46.61 16.38,45.97 21.21,45.97 21.67,46.43 21.67,47.24
SPI0_MISO  (via drill 0.35)
  Top 0.406: MCU1.27 36.96,34.79 38.48,33.27 v38.48,28.58 | J10.7 42.13,16.67 v41.4,17.4
  Bottom 0.406: v38.48,28.58 38.48,21.34 38.48,18.16 39.24,17.4 v41.4,17.4
SPI0_MOSI  (via drill 0.35)
  Top 0.406: v36.2,28.58 36.2,31.1 35.05,32.25 MCU1.29 | J10.3 46.53,12.52 v46.61,12.45
  Bottom 0.406: v46.61,12.45 38.74,12.45 36.2,14.99 v36.2,28.58
SPI0_SCK  (via drill 0.35)
  Top 0.406: v37.34,28.58 37.34,31.88 35.69,33.52 MCU1.28 | J10.5 44.33,13.34 v44.32,13.34
  Bottom 0.406: v44.32,13.34 39.24,13.34 37.34,15.24 v37.34,28.58
SPI0_SS0  (via drill 0.35)
  Top 0.406: v35.05,28.58 35.05,30.22 34.28,30.98 MCU1.30 | v47.62,11.56 J10.2 47.63,16.39 48.6,17.36 R9.1
  Bottom 0.406: v35.05,28.58 35.05,14.61 38.1,11.56 v47.62,11.56
SPI0_SS1  (via drill 0.35)
  Top 0.254: MCU1.35 31.36,24.63 30.99,24.26 v30.99,23.62
  Bottom 0.254: v30.99,23.62 TP14.P$1
V_ESP32
  Top 0.305: R13.2 59.48,50.63 57.34,52.77 56.23,52.77 | R8.2 66.04,43.43 65.53,43.94 65.53,52.96 66.29,53.72 66.29,61.72 65.77,62.25 U2.2 | R12.2 56.27,53.94 56.23,53.98
  Top 0.406: 60.71,62.3 C17.1
  Top 0.508: 56.23,52.77 C19.1
  Top 0.813: 60.65,62.25 59.32,62.25 57.58,60.5 57.58,55.93 56.23,54.58 56.23,53.98 56.23,52.77 U6.5 | 60.65,62.25 R7.2 60.71,62.3 | U2.2 60.65,62.25
VIN
  Top 0.406: U3.2 81.72,12.12 | R16.2 85.38,18 85.98,17.4 85.98,13.42
  Top 0.61: 84.33,13.72 92.8,13.72 93.09,13.42
  Top 1.016: 81.72,12.12 81.75,12.15 83.82,12.15 | 83.82,12.15 C3.1 84.5,12.2 C2.1 90.9,12.2 C8.1 99.19,12.04 J8.1 | 83.82,12.15 84.33,12.66 | 84.33,12.66 84.33,13.72 | 84.33,12.66 94.11,12.66 | 94.11,12.66 98.43,12.66 J8.1 | 84.33,13.72 84.62,13.42 85.98,13.42 93.09,13.42 | 84.33,13.72 85.09,14.48 91.31,14.48 99.19,14.48 J8.1 | 93.36,13.41 94.11,12.66
  Top 1.27: 93.36,13.44 93.36,16.49 96.43,13.42 96.9,13.42 | 91.31,14.48 92.96,16.13 93.36,16.13
  Top 2.032: J8.1 96.9,13.42 93.38,13.42 93.36,13.41
  Top 2.54: J9.PWR 93.36,16.13 93.36,13.44 93.38,13.42
WIFI_RX_MCU_TX  (via drill 0.35)
  Top 0.305: U2.10 v61.85,52.09 60.86,52.09 R12.1 | MCU1.8 47.5,48.9 48.26,49.66 56.77,49.66 v57.28,50.16
  Bottom 0.305: v61.85,52.09 59.2,52.09 v57.28,50.16
WIFI_TX_MCU_RX
  Top 0.305: U2.12 63.21,49.49 62.1,49.49 61.55,48.93 R13.1 60.62,49.02 49.53,49.02 48.77,48.26 MCU1.7

### Text on the board
tPlace: KB Chain | IOXGD | V0.4.1 | RESET | www.ioxhop.com | GND | SDA | SCL | 3V3 | 5V | MCU | Power | 7-18V | 3V3 | 47 | 45 | 43 | 41 | GND | 46 | 44 | 42 | 40 | Power | 7-18V
bPlace: 3V3 | 15 | 13 | 11 | 9 | 14 | 12 | 10 | 8 | GND | GPIO | 23 | 22 | GPIO0 | 21 | TX | NC | GND | 19 | 18 | 5 | RX | D23 | D22 | ESP32 Debug | 17 | D21 | D20 | 16 | 5V | 14 | 15 | 2 | 4 | RST | D19 | D18 | GND | D17 | D16 | CS | RS | WR | RD | RST | D0 | D1 | D2 | A | D3 | D4 | D5 | D6 | B | D7 | D8 | 3V3 | 47 | 45 | 43 | 41 | RS485 | D9 | D10 | 34 | D11 | D12 | GND | 46 | 44 | 42 | 40 | 35 | 38 | 39 | GPIO | D13 | D14 | D15 | SCK | SDA | T_SCK | MISO | MOSI | INT | BL | GND | 3V3